# EAGLE schematic DL0WH_BiTuner_Ctrl_1V3 (EAGLE 7.7.0)

## Sheet 1 of 17: MCU
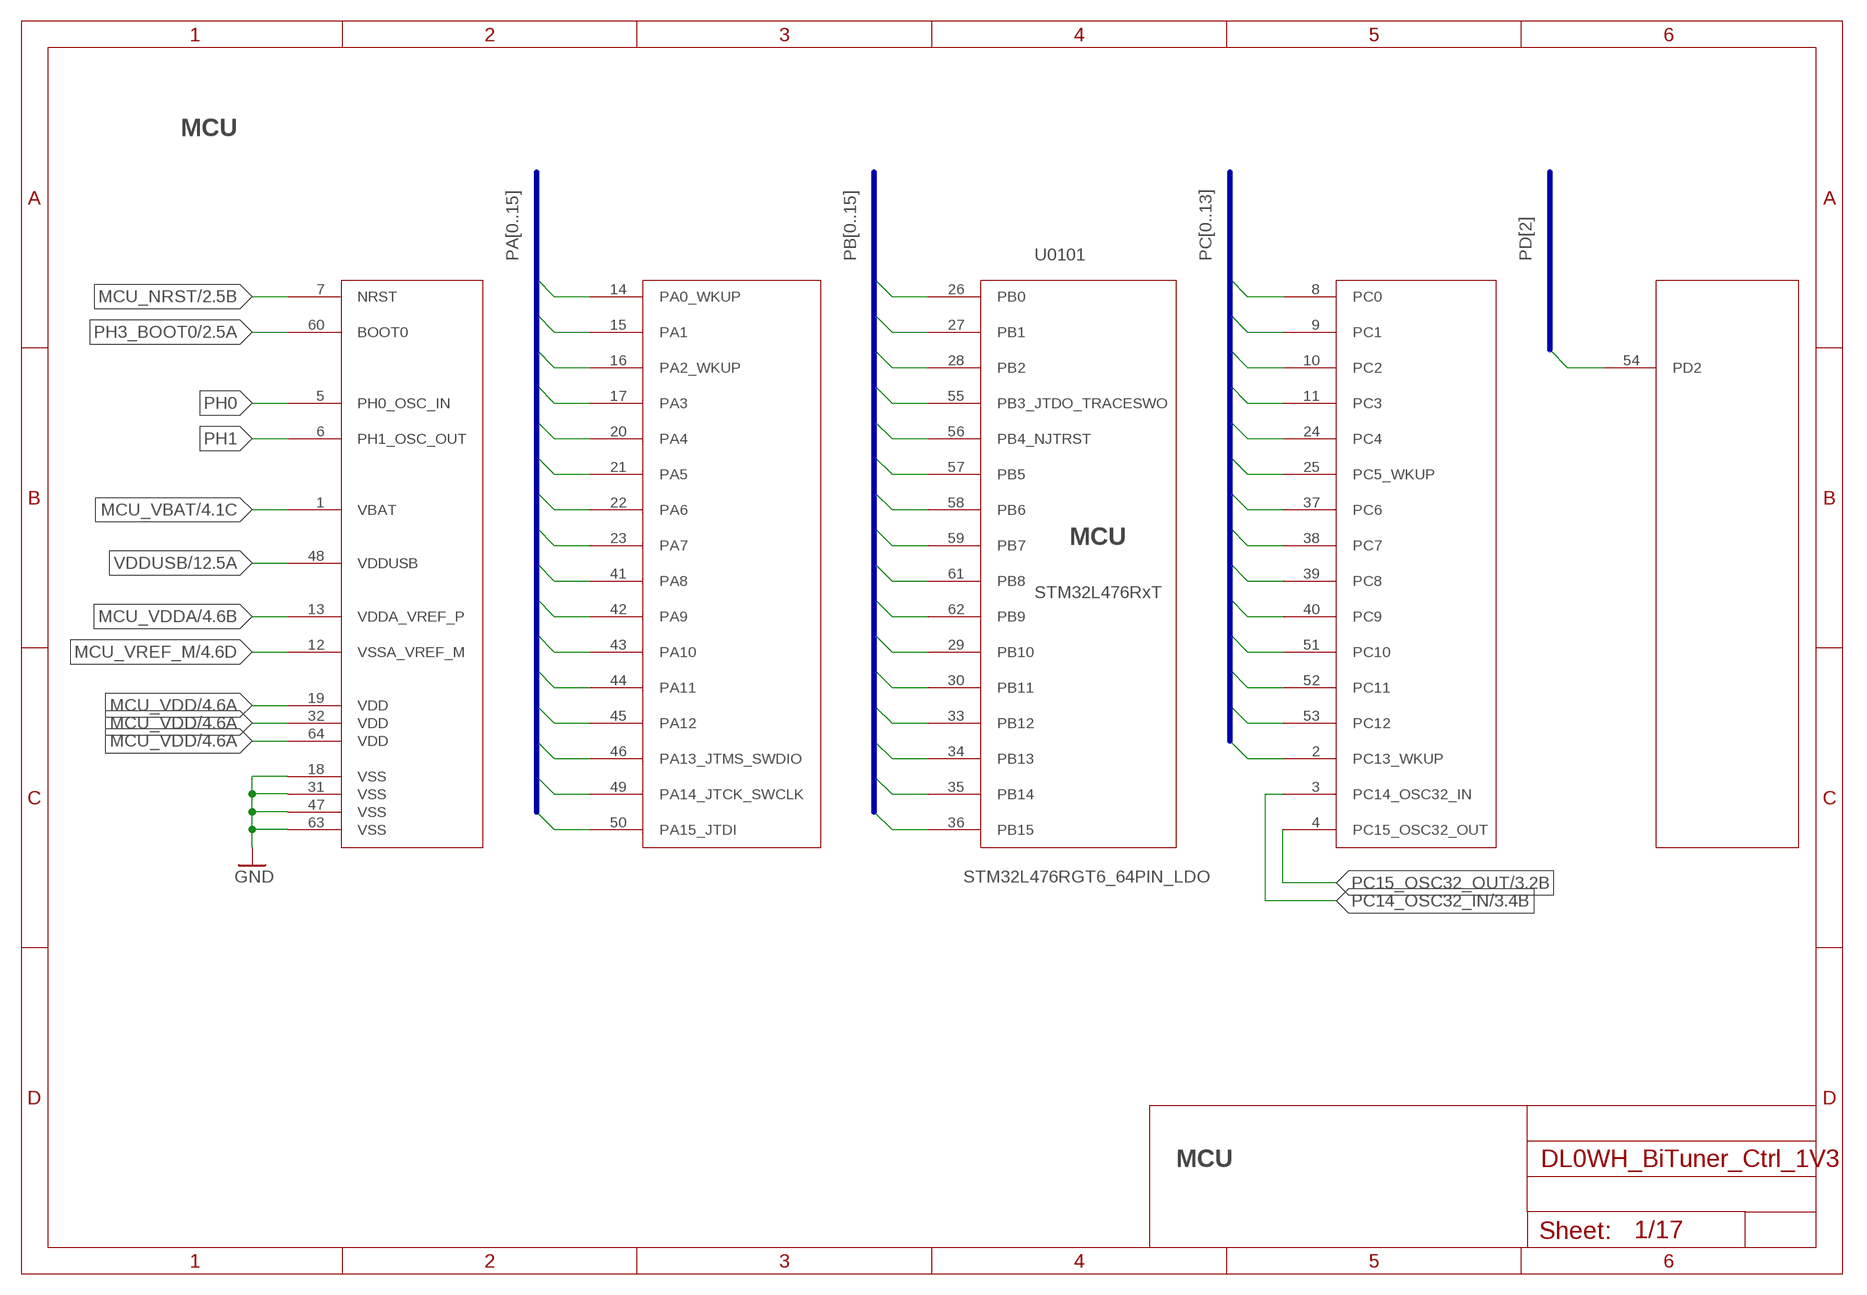
[diagram p0: schematic, sheet 1]

### Parts
U0101  STM32L476RGT6_64PIN_LDO  STM32L476RXT_64PIN_LDO  [LQFP64]

### Nets
GND: U0101.18(VSS) U0101.31(VSS) U0101.47(VSS) U0101.63(VSS) ; also sheet 2,3,4,5,6,7,8,9,10,11,12,13,14,15,17
MCU_NRST: U0101.7(NRST) ; also sheet 2
MCU_VBAT: U0101.1(VBAT) ; also sheet 4
MCU_VDD: U0101.19(VDD) U0101.32(VDD) U0101.64(VDD) ; also sheet 4
MCU_VDDA: U0101.13(VDDA_VREF_P) ; also sheet 4
MCU_VREF_M: U0101.12(VSSA_VREF_M) ; also sheet 4
PA0: U0101.14(PA0_WKUP) ; also sheet 11
PA1: U0101.15(PA1) ; also sheet 11
PA2: U0101.16(PA2_WKUP)
PA3: U0101.17(PA3) ; also sheet 9
PA4: U0101.20(PA4)
PA5: U0101.21(PA5) ; also sheet 6
PA6: U0101.22(PA6) ; also sheet 6
PA7: U0101.23(PA7) ; also sheet 6
PA8: U0101.41(PA8)
PA9: U0101.42(PA9) ; also sheet 14
PA10: U0101.43(PA10) ; also sheet 14
PA11: U0101.44(PA11) ; also sheet 14
PA12: U0101.45(PA12) ; also sheet 14
PA13: U0101.46(PA13_JTMS_SWDIO) ; also sheet 2
PA14: U0101.49(PA14_JTCK_SWCLK) ; also sheet 2
PA15: U0101.50(PA15_JTDI) ; also sheet 11
PB0: U0101.26(PB0) ; also sheet 6
PB1: U0101.27(PB1) ; also sheet 7
PB2: U0101.28(PB2) ; also sheet 8
PB3: U0101.55(PB3_JTDO_TRACESWO)
PB4: U0101.56(PB4_NJTRST)
PB5: U0101.57(PB5)
PB6: U0101.58(PB6) ; also sheet 5,9
PB7: U0101.59(PB7) ; also sheet 11
PB8: U0101.61(PB8)
PB9: U0101.62(PB9) ; also sheet 5,9
PB10 [mil6_nofill]: U0101.29(PB10) ; also sheet 10
PB11: U0101.30(PB11) ; also sheet 6
PB12: U0101.33(PB12) ; also sheet 10
PB13 [mil6_nofill]: U0101.34(PB13) ; also sheet 10
PB14: U0101.35(PB14)
PB15: U0101.36(PB15)
PC0 [mil6_nofill]: U0101.8(PC0) ; also sheet 9
PC1: U0101.9(PC1) ; also sheet 10
PC2 [mil6_nofill]: U0101.10(PC2) ; also sheet 9
PC3: U0101.11(PC3) ; also sheet 9
PC4: U0101.24(PC4) ; also sheet 6
PC5: U0101.25(PC5_WKUP)
PC6: U0101.37(PC6)
PC7: U0101.38(PC7)
PC8: U0101.39(PC8)
PC9: U0101.40(PC9)
PC10: U0101.51(PC10)
PC11: U0101.52(PC11)
PC12: U0101.53(PC12)
PC13: U0101.2(PC13_WKUP)
PC14_OSC32_IN: U0101.3(PC14_OSC32_IN) ; also sheet 3
PC15_OSC32_OUT: U0101.4(PC15_OSC32_OUT) ; also sheet 3
PD2: U0101.54(PD2)
PH0: U0101.5(PH0_OSC_IN)
PH1: U0101.6(PH1_OSC_OUT)
PH3_BOOT0: U0101.60(BOOT0) ; also sheet 2
VDDUSB: U0101.48(VDDUSB) ; also sheet 12,14

### Buses
PB[0..15]
PA[0..15]
PC[0..13]
PD[2]

### Notes on the sheet
- MCU
- MCU
- STM32L476RxT
- MCU

## Sheet 2 of 17: MCU Debug
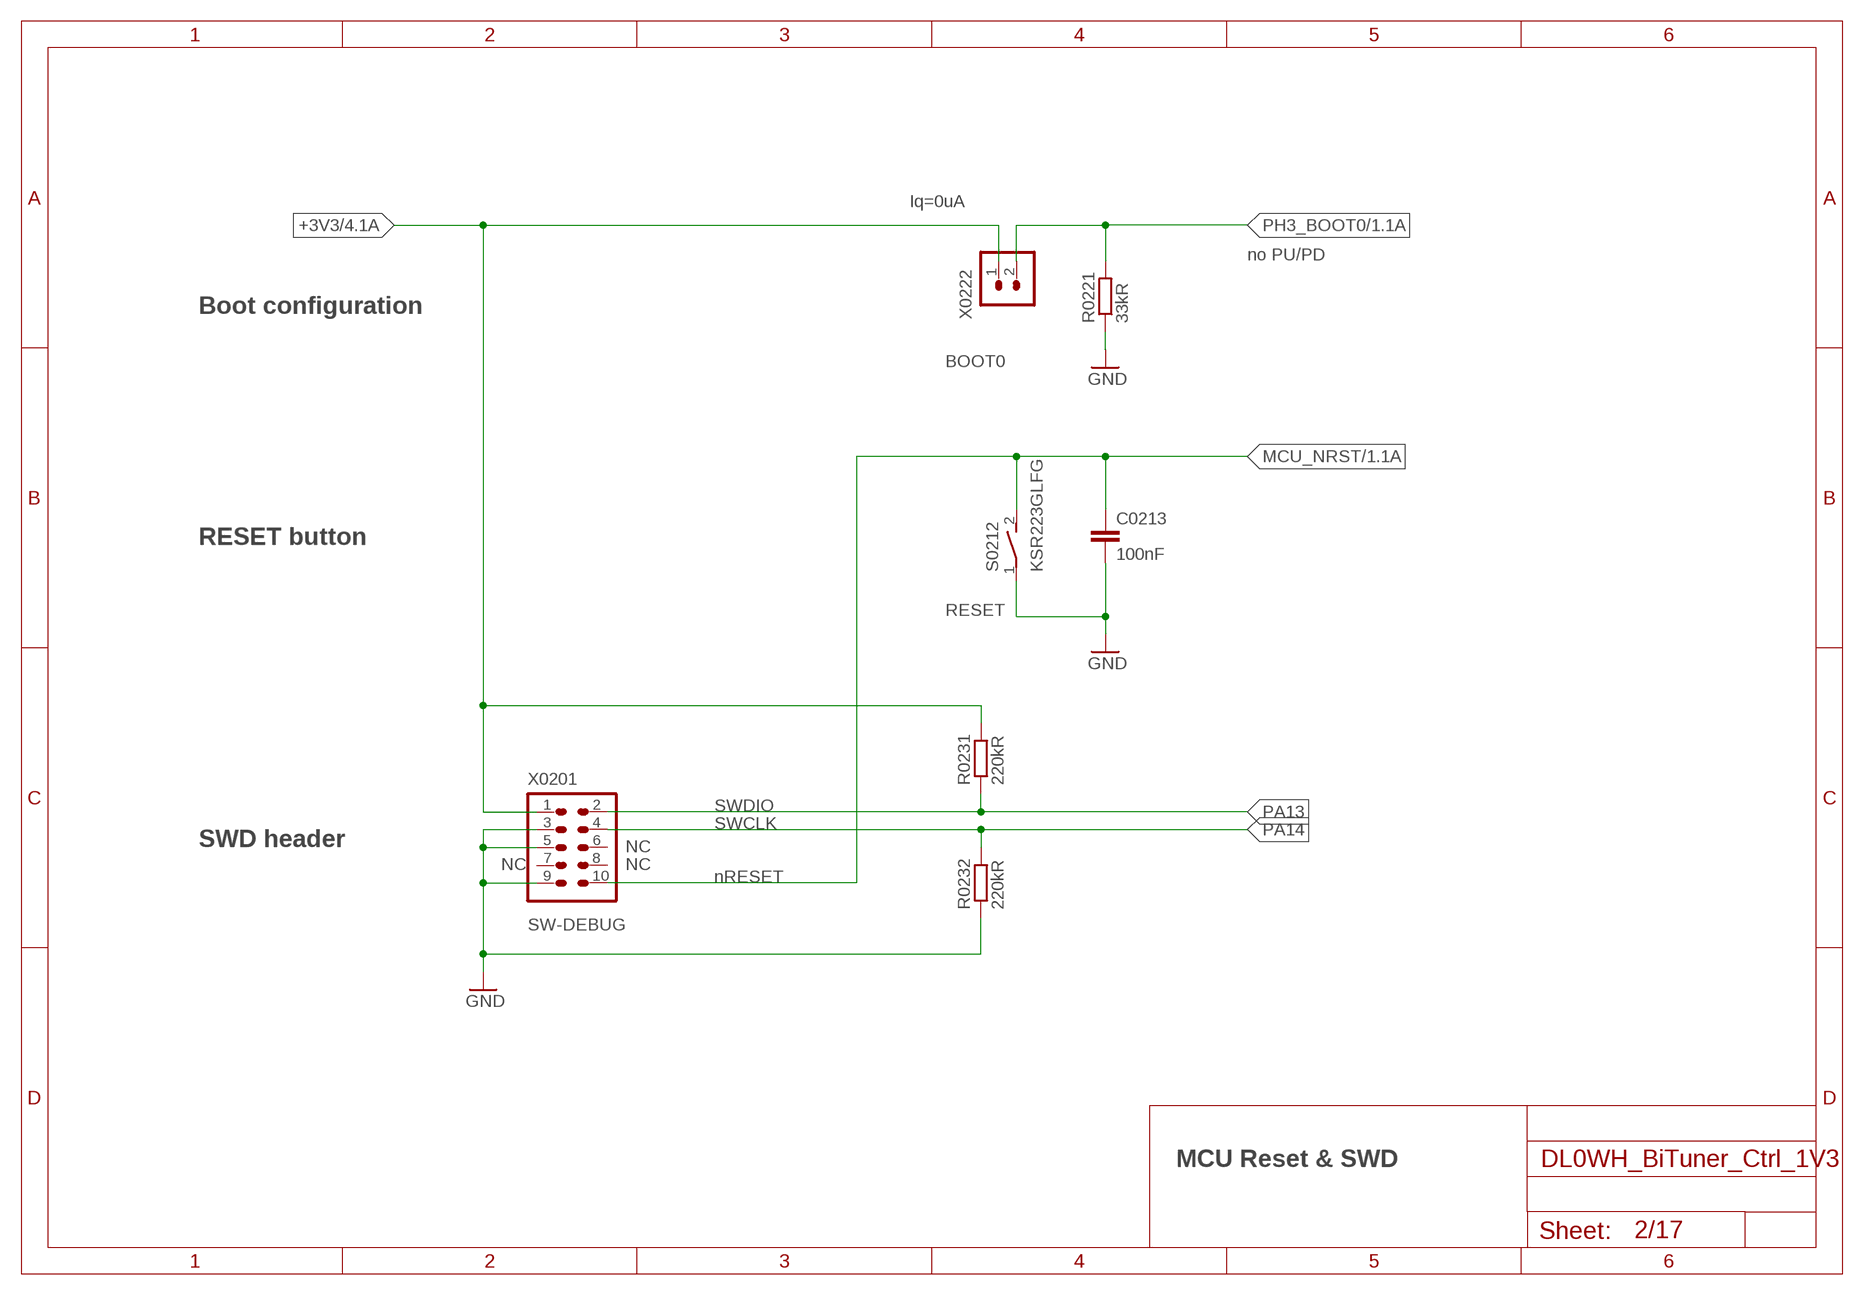
[diagram p1: schematic, sheet 2]

### Parts
C0213  100nF  C-EUC0402  [C0402]
R0221  33kR  R-EU_R0402  [R0402]
R0231  220kR  R-EU_R0402  [R0402]
R0232  220kR  R-EU_R0402  [R0402]
S0212  KSR223GLFG  KSR223G_SMD_1POL  [KSR223G_SMD_1POL]
X0201  FTSH-105-01-F-D-K  2X05_1MM27_SHROUDED_CORTEX_JTAG_SWD"  [2X05_1MM27_SHROUDED_CORTEX_JTAG_SWD]
X0222  HEADER-1X2  [1X02]

### Nets
+3V3: R0231.2 X0201.1 X0222.1 ; also sheet 4,5,6,7,8,9,13
GND: C0213.2 R0221.1 R0232.1 S0212.1(P) X0201.3 X0201.5 X0201.9 ; also sheet 1,3,4,5,6,7,8,9,10,11,12,13,14,15,17
MCU_NRST: C0213.1 S0212.2(S) X0201.10 ; also sheet 1
PA13: R0231.1 X0201.2 ; also sheet 1
PA14: R0232.2 X0201.4 ; also sheet 1
PH3_BOOT0: R0221.2 X0222.2 ; also sheet 1
Unconnected: X0201.6 X0201.7 X0201.8

### Notes on the sheet
- Iq=0uA
- no PU/PD
- Boot configuration
- BOOT0
- RESET button
- RESET
- SWDIO
- SWCLK
- SWD header
- NC
- NC | NC
- nRESET
- SW-DEBUG
- MCU Reset & SWD

## Sheet 3 of 17: MCU LSE 32.768 kHz
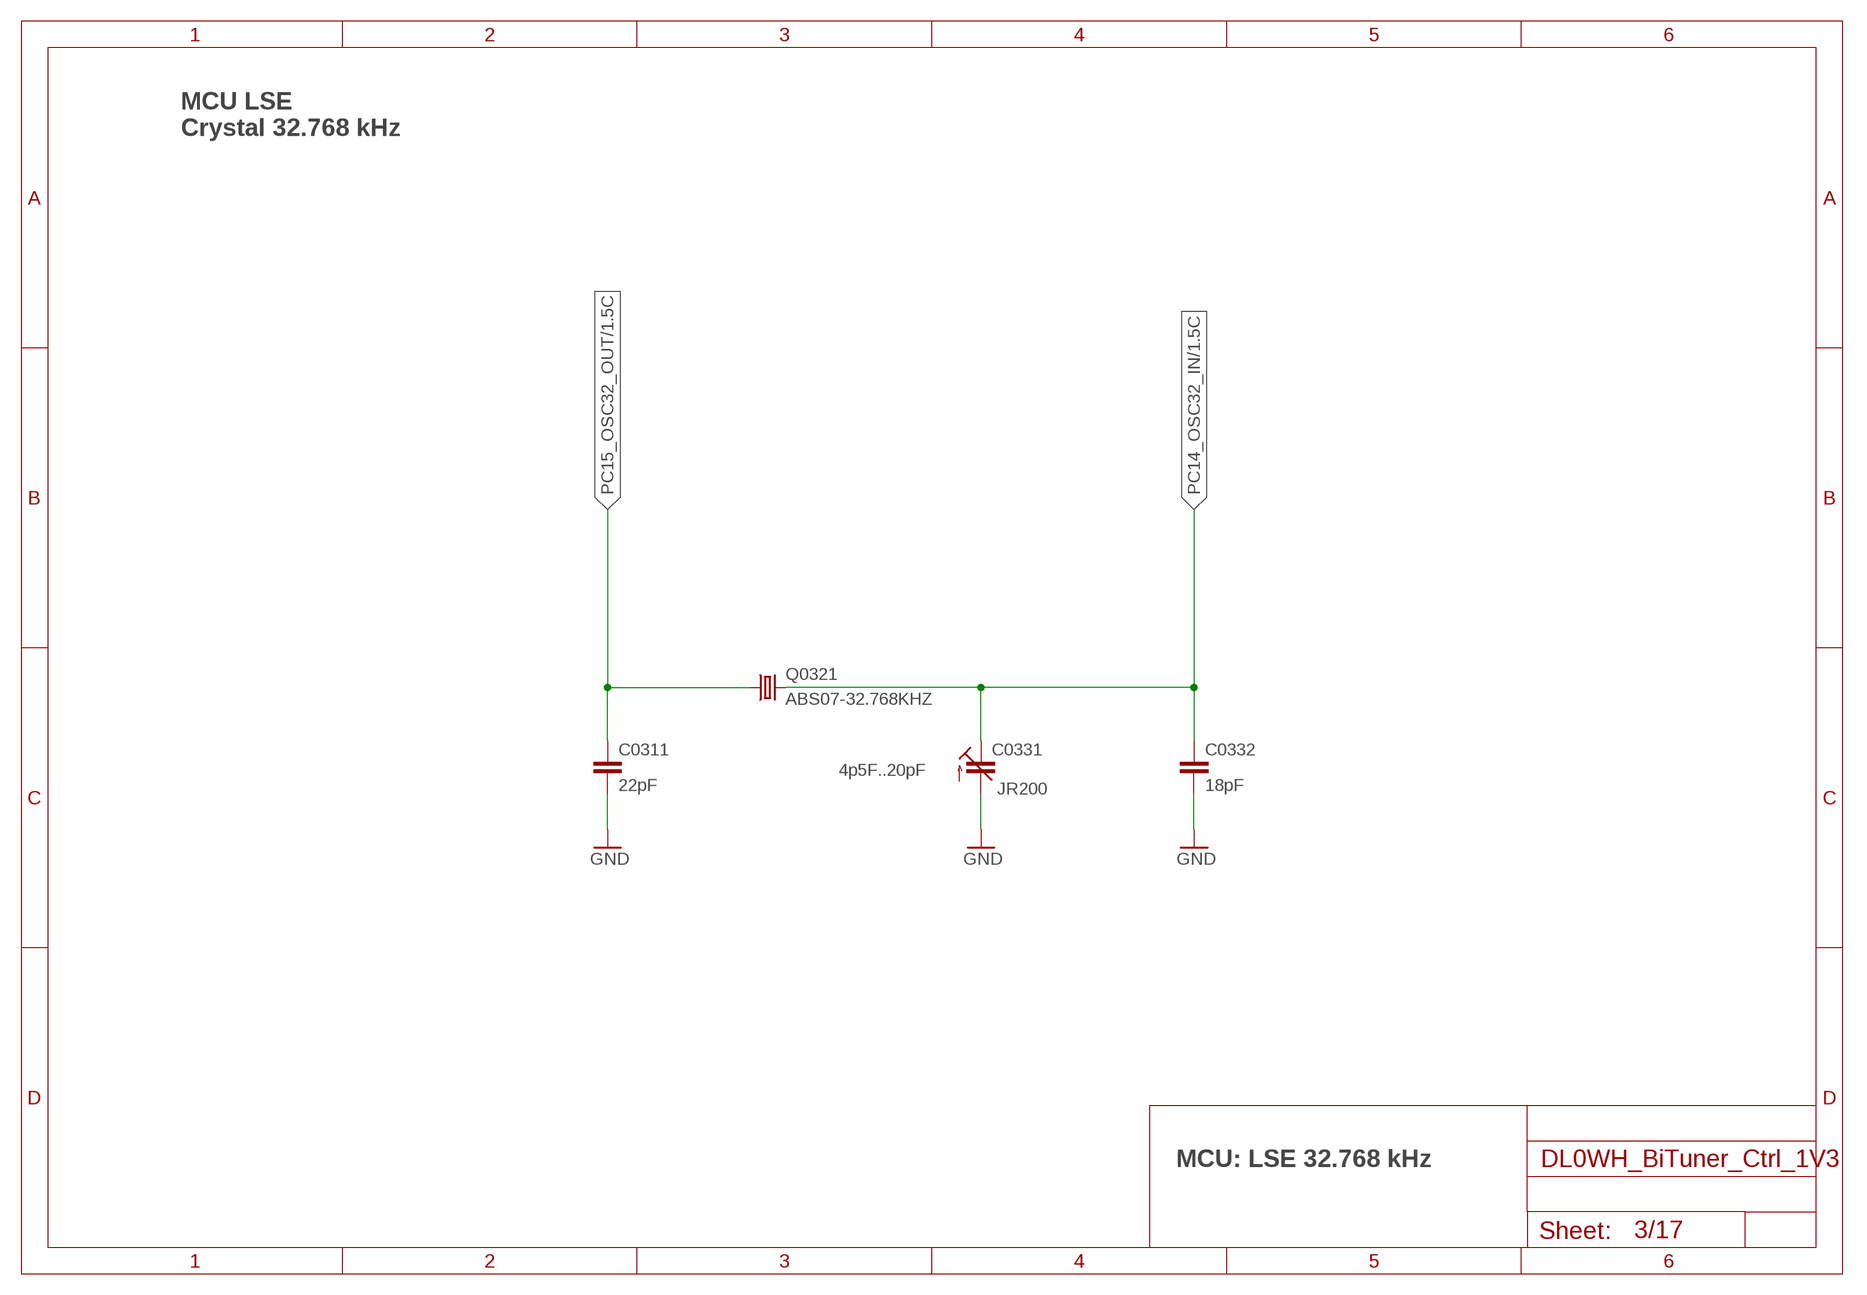
[diagram p2: schematic, sheet 3]

### Parts
C0311  22pF  C-EUC0402  [C0402]
C0331  JR200  C-TRIMM3MM2_2MM5  [3MM2_X_2MM5]
C0332  18pF  C-EUC0402  [C0402]
Q0321  ABS07-32.768KHZ  [ABS07]

### Nets
GND: C0311.2 C0331.+(A) C0332.2 ; also sheet 1,2,4,5,6,7,8,9,10,11,12,13,14,15,17
PC14_OSC32_IN: C0331.-(E) C0332.1 Q0321.2 ; also sheet 1
PC15_OSC32_OUT: C0311.1 Q0321.1 ; also sheet 1

### Notes on the sheet
- MCU LSE
  Crystal 32.768 kHz
- 4p5F..20pF
- MCU: LSE 32.768 kHz

## Sheet 4 of 17: MCU Power Distribution
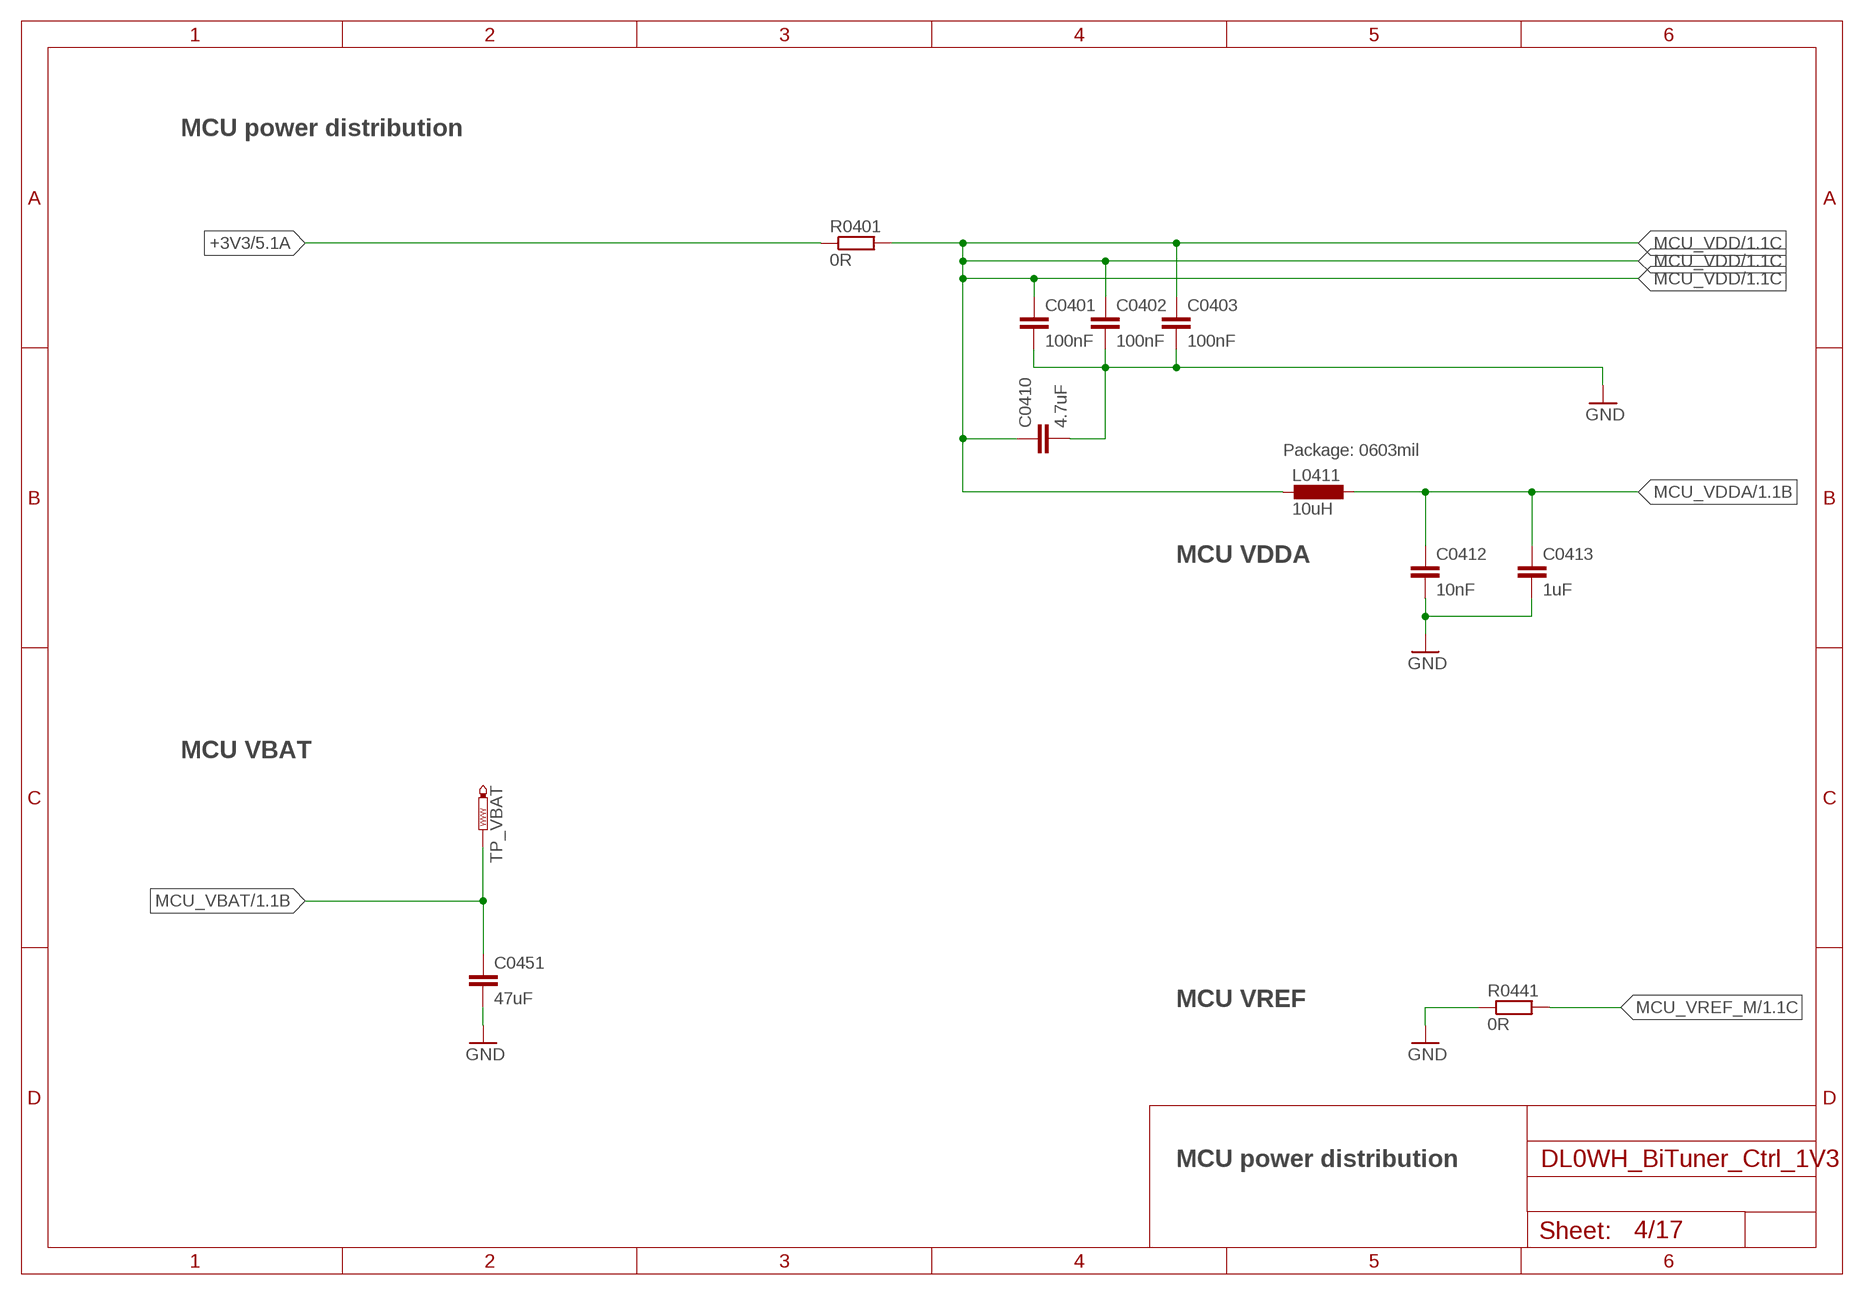
[diagram p3: schematic, sheet 4]

### Parts
C0401  100nF  C-EUC0402  [C0402]
C0402  100nF  C-EUC0402  [C0402]
C0403  100nF  C-EUC0402  [C0402]
C0410  4.7uF  C-EUC0603  [C0603]
C0412  10nF  C-EUC0402  [C0402]
C0413  1uF  C-EUC0402  [C0402]
C0451  47uF  C-EUC0805  [C0805]
L0411  10uH  L-EUL0603  [L0603]
R0401  0R  R-EU_R0402  [R0402]
R0441  0R  R-EU_R0402  [R0402]
TP_VBAT  PTR1B1,27  [B1,27]

### Nets
+3V3: R0401.1 ; also sheet 2,5,6,7,8,9,13
GND: C0401.2 C0402.2 C0403.2 C0410.2 C0412.2 C0413.2 C0451.2 R0441.1 ; also sheet 1,2,3,5,6,7,8,9,10,11,12,13,14,15,17
MCU_VBAT: C0451.1 TP_VBAT.TP ; also sheet 1
MCU_VDD: C0401.1 C0402.1 C0403.1 C0410.1 L0411.1 R0401.2 ; also sheet 1
MCU_VDDA: C0412.1 C0413.1 L0411.2 ; also sheet 1
MCU_VREF_M: R0441.2 ; also sheet 1

### Notes on the sheet
- MCU power distribution
- Package: 0603mil
- MCU VDDA
- MCU VBAT
- MCU VREF
- MCU power distribution

## Sheet 5 of 17: I2C1 Termination / Addr space
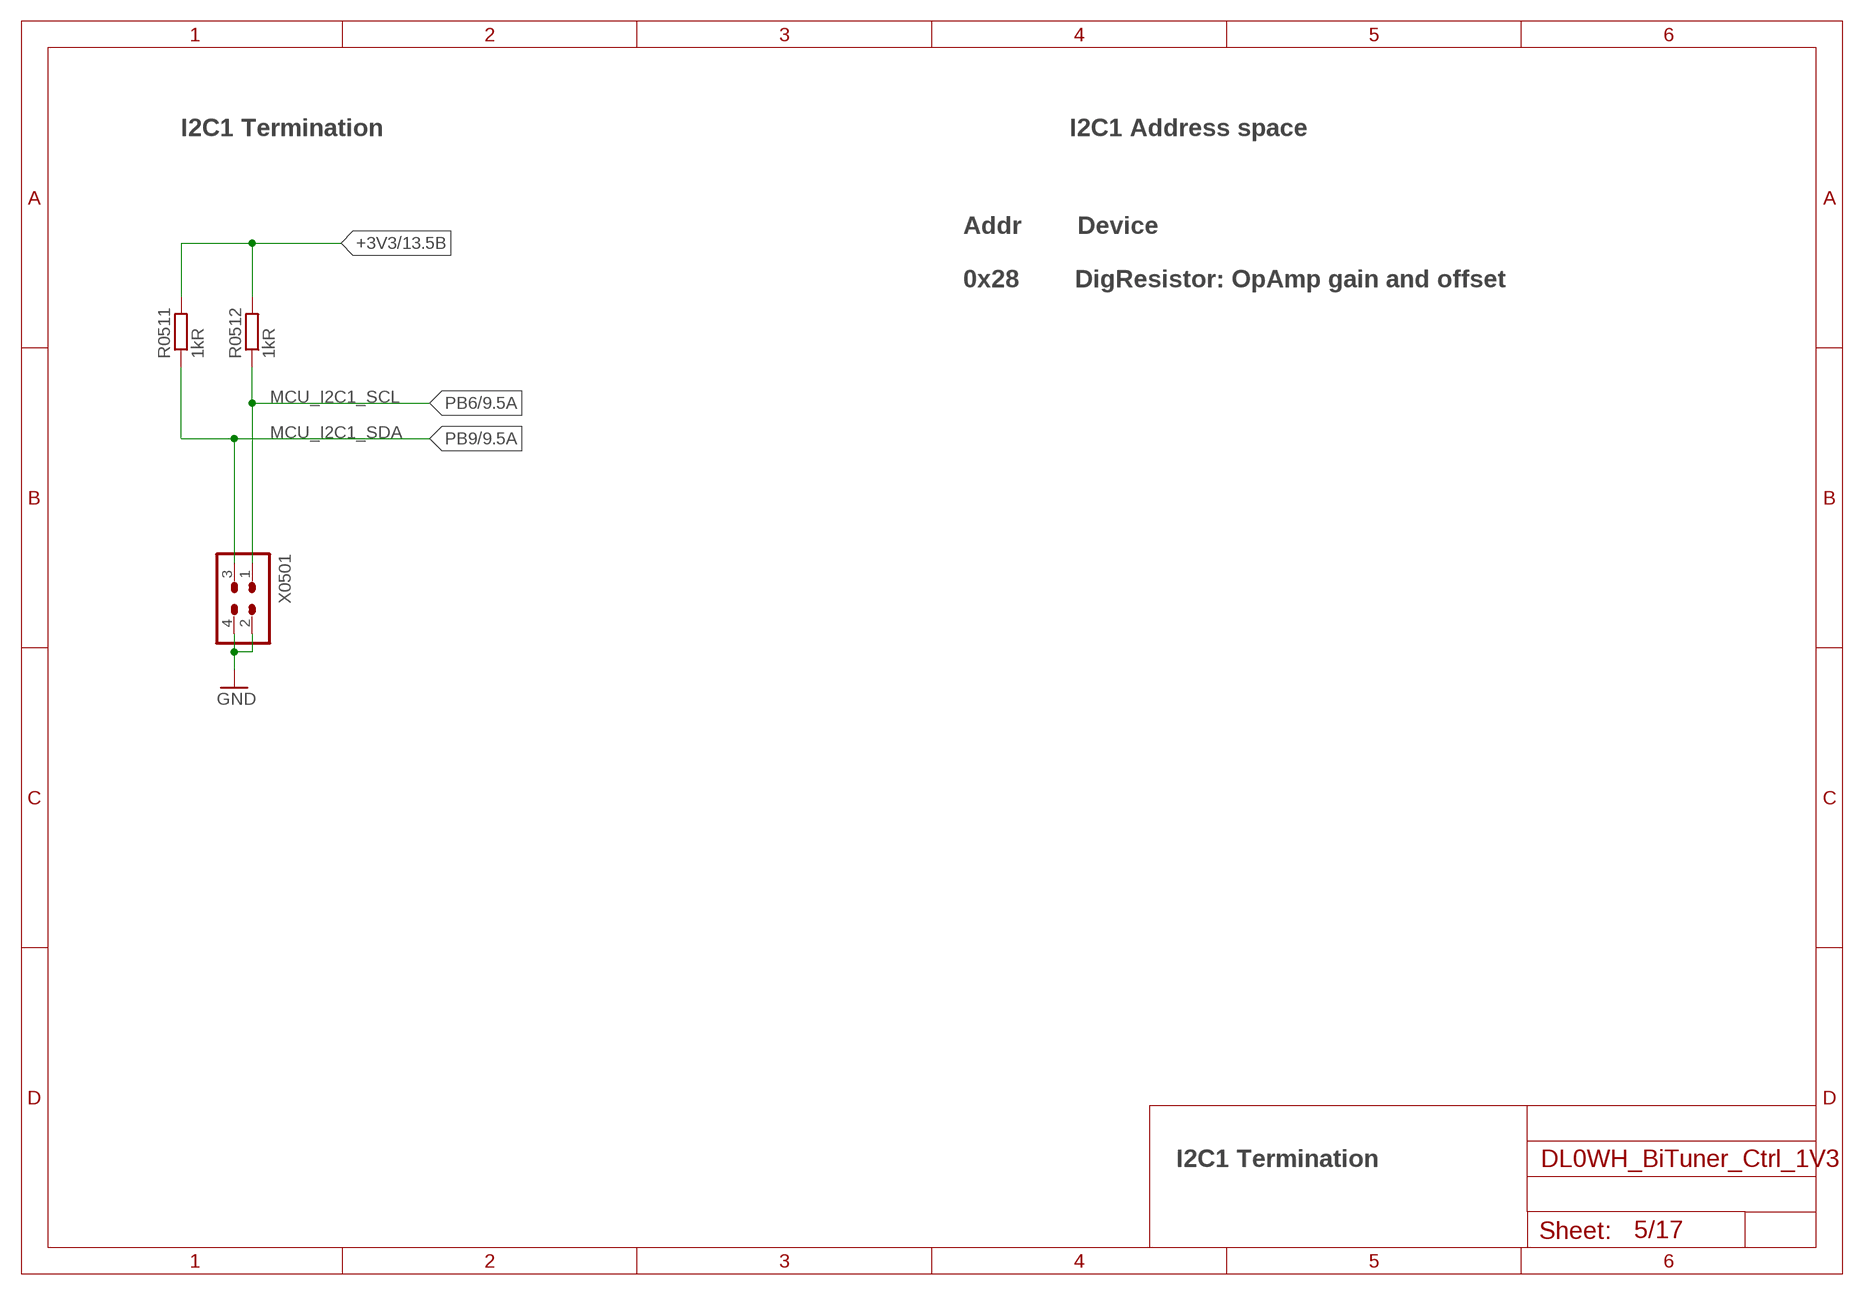
[diagram p4: schematic, sheet 5]

### Parts
R0511  1kR  R-EU_R0402  [R0402]
R0512  1kR  R-EU_R0402  [R0402]
X0501  HEADER-2X2  [2X02]

### Nets
+3V3: R0511.2 R0512.2 ; also sheet 2,4,6,7,8,9,13
GND: X0501.2 X0501.4 ; also sheet 1,2,3,4,6,7,8,9,10,11,12,13,14,15,17
PB6: R0512.1 X0501.1 ; also sheet 1,9
PB9: R0511.1 X0501.3 ; also sheet 1,9

### Notes on the sheet
- I2C1 Termination | I2C1 Address space
- Addr        Device
  
  0x28        DigResistor: OpAmp gain and offset
- MCU_I2C1_SCL
- MCU_I2C1_SDA
- I2C1 Termination

## Sheet 6 of 17: SPI solenoid driver - L
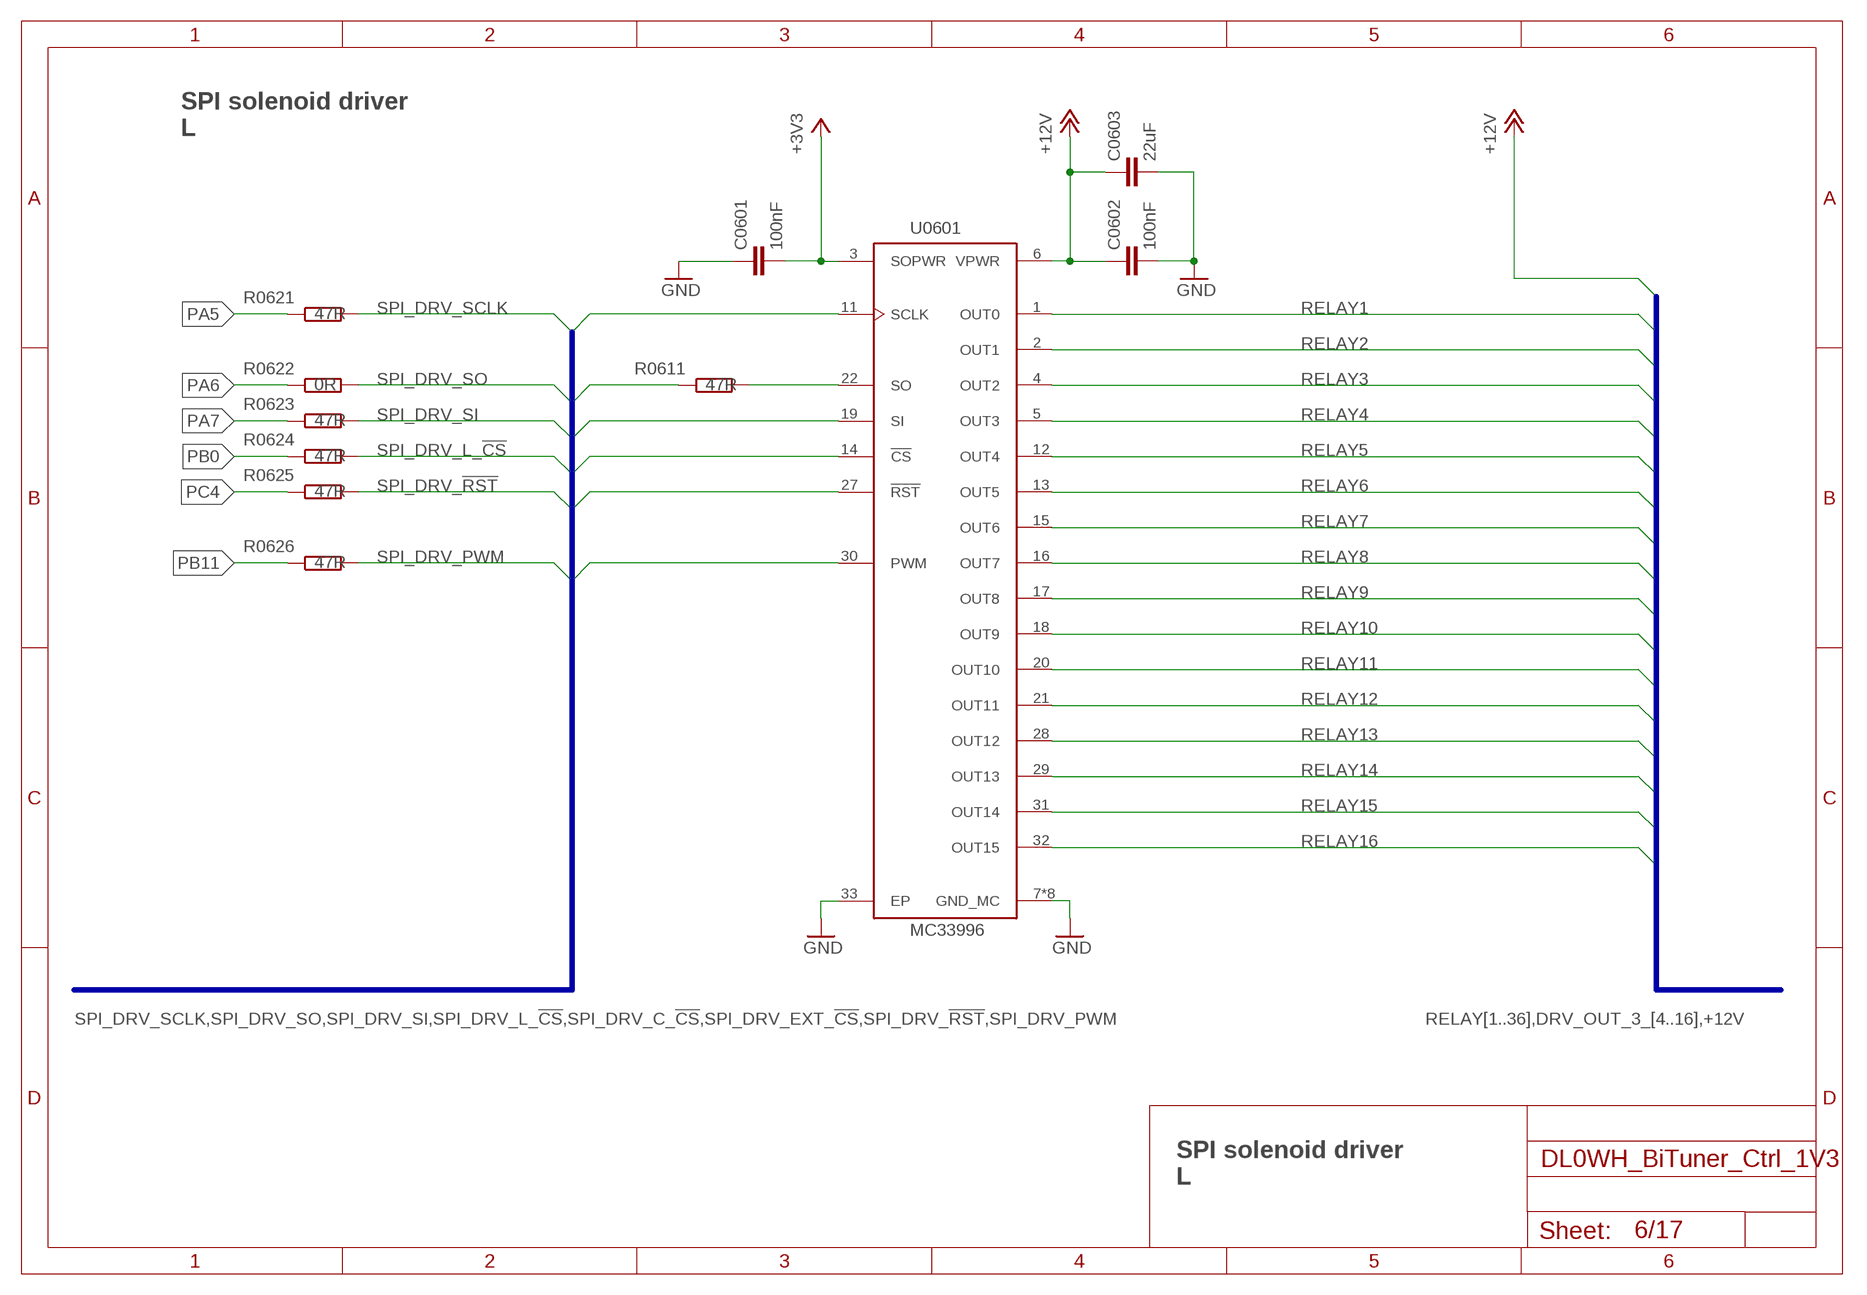
[diagram p5: schematic, sheet 6]

### Parts
C0601  100nF  C-EUC0402  [C0402]
C0602  100nF  C-EUC0402  [C0402]
C0603  22uF  C-EUC0603  [C0603]
R0611  47R  R-EU_R0402  [R0402]
R0621  47R  R-EU_R0402  [R0402]
R0622  0R  R-EU_R0402  [R0402]
R0623  47R  R-EU_R0402  [R0402]
R0624  47R  R-EU_R0402  [R0402]
R0625  47R  R-EU_R0402  [R0402]
R0626  47R  R-EU_R0402  [R0402]
U0601  MC33996  [SOICW32]

### Nets
+3V3: C0601.2 U0601.3(SOPWR) ; also sheet 2,4,5,7,8,9,13
+12V: C0602.1 C0603.1 U0601.6(VPWR) ; also sheet 7,8,12,16
GND: C0601.1 C0602.2 C0603.2 U0601.7(GND_MC) U0601.8(GND_MC) U0601.9(GND_MC) U0601.10(GND_MC) U0601.23(GND_MC) U0601.24(GND_MC) U0601.25(GND_MC) U0601.26(GND_MC) U0601.33(EP) ; also sheet 1,2,3,4,5,7,8,9,10,11,12,13,14,15,17
N$12: R0611.2 U0601.22(SO)
PA5: R0621.1 ; also sheet 1
PA6: R0622.1 ; also sheet 1
PA7: R0623.1 ; also sheet 1
PB0: R0624.1 ; also sheet 1
PB11: R0626.1 ; also sheet 1
PC4: R0625.1 ; also sheet 1
RELAY1 [mil6_nofill]: U0601.1(OUT0) ; also sheet 16
RELAY2 [mil6_nofill]: U0601.2(OUT1) ; also sheet 16
RELAY3 [mil6_nofill]: U0601.4(OUT2) ; also sheet 16
RELAY4 [mil6_nofill]: U0601.5(OUT3) ; also sheet 16
RELAY5 [mil6_nofill]: U0601.12(OUT4) ; also sheet 16
RELAY6 [mil6_nofill]: U0601.13(OUT5) ; also sheet 16
RELAY7 [mil6_nofill]: U0601.15(OUT6) ; also sheet 16
RELAY8 [mil6_nofill]: U0601.16(OUT7) ; also sheet 16
RELAY9: U0601.17(OUT8) ; also sheet 16
RELAY10 [mil6_nofill]: U0601.18(OUT9) ; also sheet 16
RELAY11 [mil6_nofill]: U0601.20(OUT10) ; also sheet 16
RELAY12 [mil6_nofill]: U0601.21(OUT11) ; also sheet 16
RELAY13: U0601.28(OUT12) ; also sheet 16
RELAY14: U0601.29(OUT13) ; also sheet 16
RELAY15: U0601.31(OUT14) ; also sheet 16
RELAY16 [mil6_nofill]: U0601.32(OUT15) ; also sheet 16
SPI_DRV_!RST [mil6_nofill]: R0625.2 U0601.27(!RST) ; also sheet 7,8
SPI_DRV_L_!CS [mil6_nofill]: R0624.2 U0601.14(!CS)
SPI_DRV_PWM [mil6_nofill]: R0626.2 U0601.30(PWM) ; also sheet 7,8
SPI_DRV_SCLK [mil6_nofill]: R0621.2 U0601.11(SCLK) ; also sheet 7,8
SPI_DRV_SI [mil6_nofill]: R0623.2 U0601.19(SI) ; also sheet 7,8
SPI_DRV_SO [mil6_nofill]: R0611.1 R0622.2 ; also sheet 7,8

### Buses
RELAY[1..36],DRV_OUT_3_[4..16],+12V
SPI_DRV_SCLK,SPI_DRV_SO,SPI_DRV_SI,SPI_DRV_L_!CS,SPI_DRV_C_!CS,SPI_DRV_EXT_!CS,SPI_DRV_!RST,SPI_DRV_PWM

### Notes on the sheet
- SPI solenoid driver
  L
- SPI solenoid driver
  L

## Sheet 7 of 17: SPI solenoid driver - C
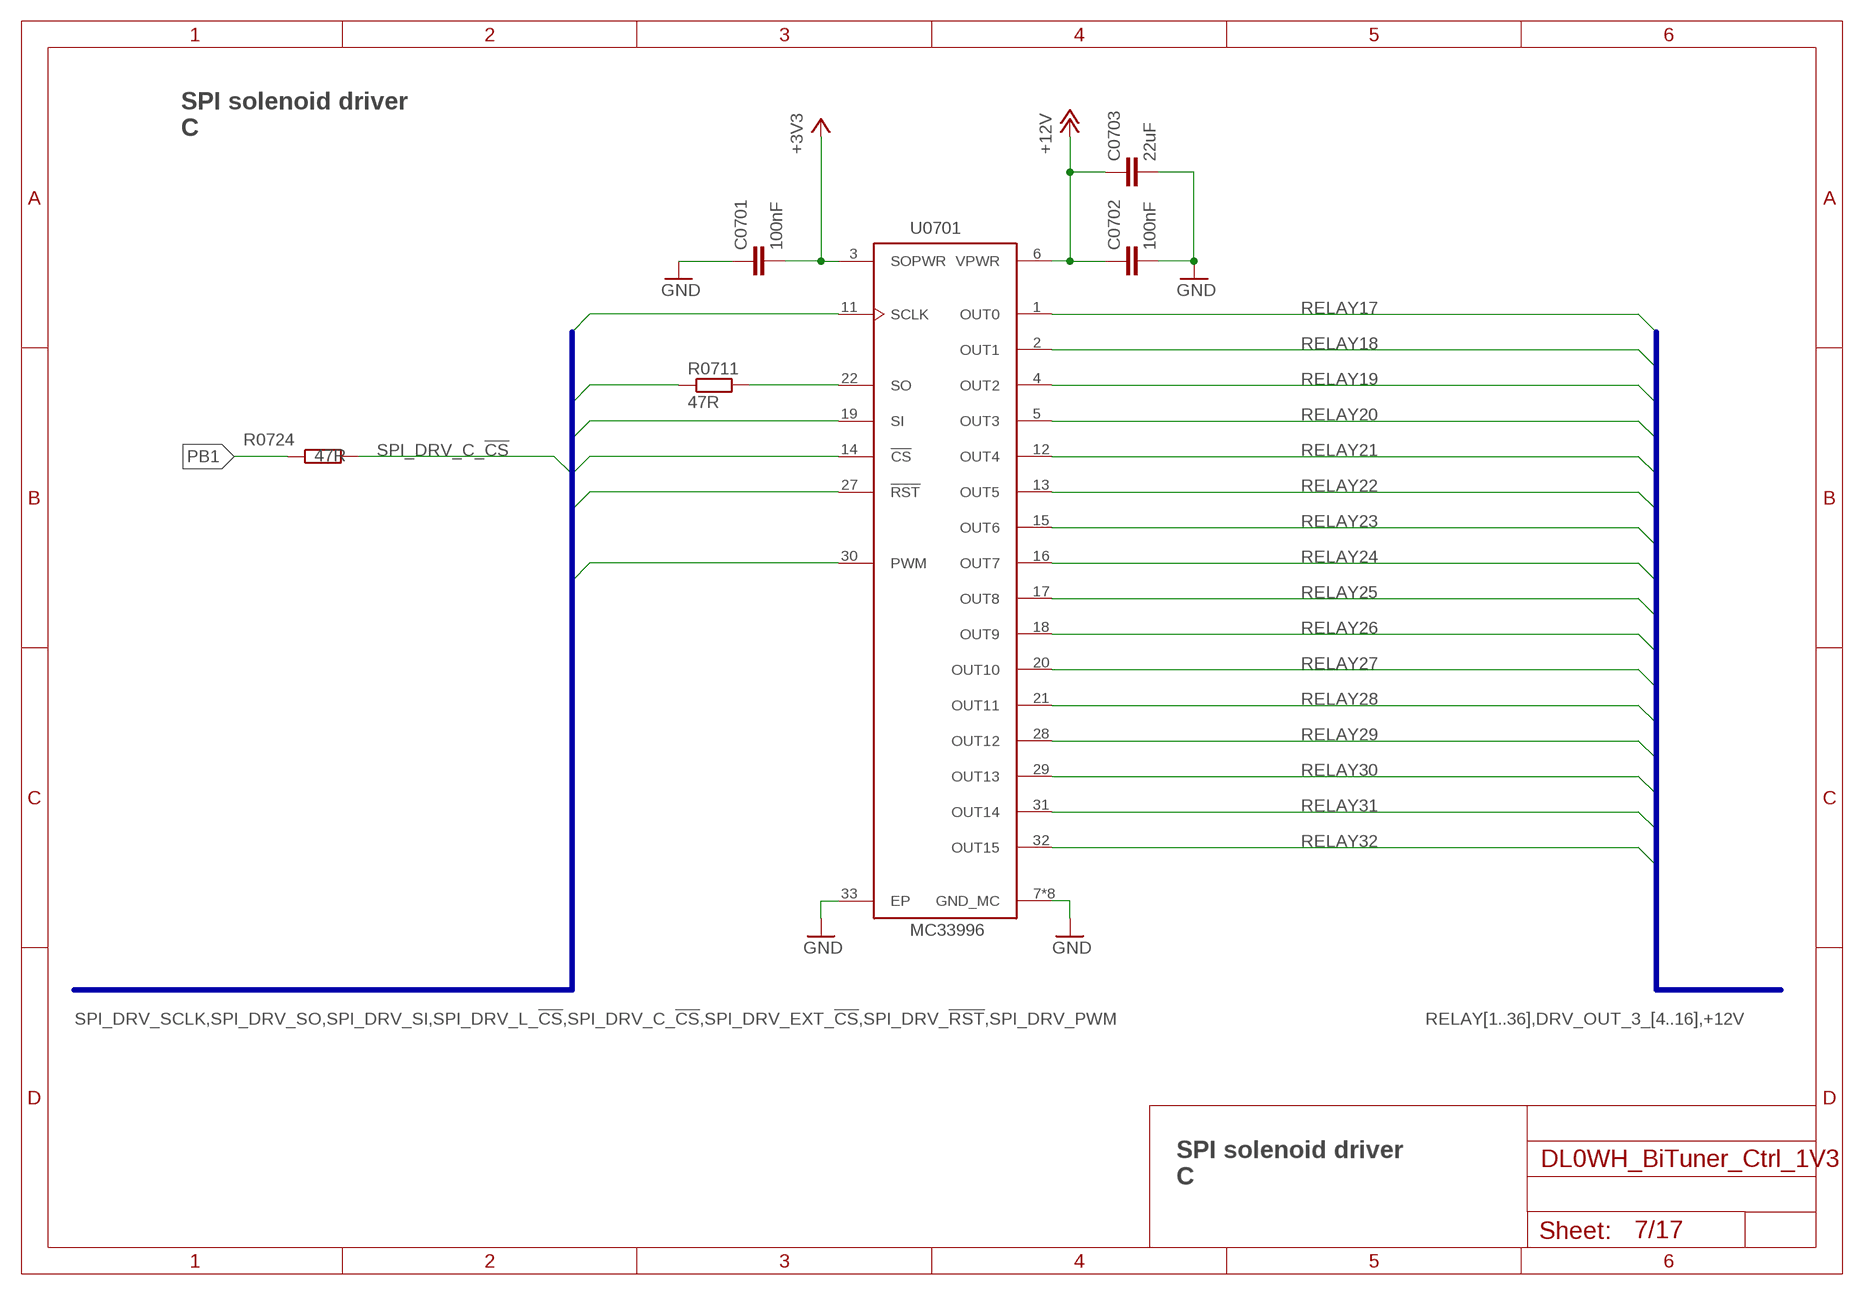
[diagram p6: schematic, sheet 7]

### Parts
C0701  100nF  C-EUC0402  [C0402]
C0702  100nF  C-EUC0402  [C0402]
C0703  22uF  C-EUC0603  [C0603]
R0711  47R  R-EU_R0402  [R0402]
R0724  47R  R-EU_R0402  [R0402]
U0701  MC33996  [SOICW32]

### Nets
+3V3: C0701.2 U0701.3(SOPWR) ; also sheet 2,4,5,6,8,9,13
+12V: C0702.1 C0703.1 U0701.6(VPWR) ; also sheet 6,8,12,16
GND: C0701.1 C0702.2 C0703.2 U0701.7(GND_MC) U0701.8(GND_MC) U0701.9(GND_MC) U0701.10(GND_MC) U0701.23(GND_MC) U0701.24(GND_MC) U0701.25(GND_MC) U0701.26(GND_MC) U0701.33(EP) ; also sheet 1,2,3,4,5,6,8,9,10,11,12,13,14,15,17
N$13: R0711.2 U0701.22(SO)
PB1: R0724.1 ; also sheet 1
RELAY17 [mil6_nofill]: U0701.1(OUT0) ; also sheet 16
RELAY18 [mil6_nofill]: U0701.2(OUT1) ; also sheet 16
RELAY19 [mil6_nofill]: U0701.4(OUT2) ; also sheet 16
RELAY20 [mil6_nofill]: U0701.5(OUT3) ; also sheet 16
RELAY21 [mil6_nofill]: U0701.12(OUT4) ; also sheet 16
RELAY22 [mil6_nofill]: U0701.13(OUT5) ; also sheet 16
RELAY23 [mil6_nofill]: U0701.15(OUT6) ; also sheet 16
RELAY24 [mil6_nofill]: U0701.16(OUT7) ; also sheet 16
RELAY25 [mil6_nofill]: U0701.17(OUT8) ; also sheet 16
RELAY26 [mil6_nofill]: U0701.18(OUT9) ; also sheet 16
RELAY27 [mil6_nofill]: U0701.20(OUT10) ; also sheet 16
RELAY28 [mil6_nofill]: U0701.21(OUT11) ; also sheet 16
RELAY29 [mil6_nofill]: U0701.28(OUT12) ; also sheet 16
RELAY30 [mil6_nofill]: U0701.29(OUT13) ; also sheet 16
RELAY31 [mil6_nofill]: U0701.31(OUT14) ; also sheet 16
RELAY32 [mil6_nofill]: U0701.32(OUT15) ; also sheet 16
SPI_DRV_!RST [mil6_nofill]: U0701.27(!RST) ; also sheet 6,8
SPI_DRV_C_!CS [mil6_nofill]: R0724.2 U0701.14(!CS)
SPI_DRV_PWM [mil6_nofill]: U0701.30(PWM) ; also sheet 6,8
SPI_DRV_SCLK [mil6_nofill]: U0701.11(SCLK) ; also sheet 6,8
SPI_DRV_SI [mil6_nofill]: U0701.19(SI) ; also sheet 6,8
SPI_DRV_SO [mil6_nofill]: R0711.1 ; also sheet 6,8

### Buses
RELAY[1..36],DRV_OUT_3_[4..16],+12V
SPI_DRV_SCLK,SPI_DRV_SO,SPI_DRV_SI,SPI_DRV_L_!CS,SPI_DRV_C_!CS,SPI_DRV_EXT_!CS,SPI_DRV_!RST,SPI_DRV_PWM

### Notes on the sheet
- SPI solenoid driver
  C
- SPI solenoid driver
  C

## Sheet 8 of 17: SPI solenoid driver - extra
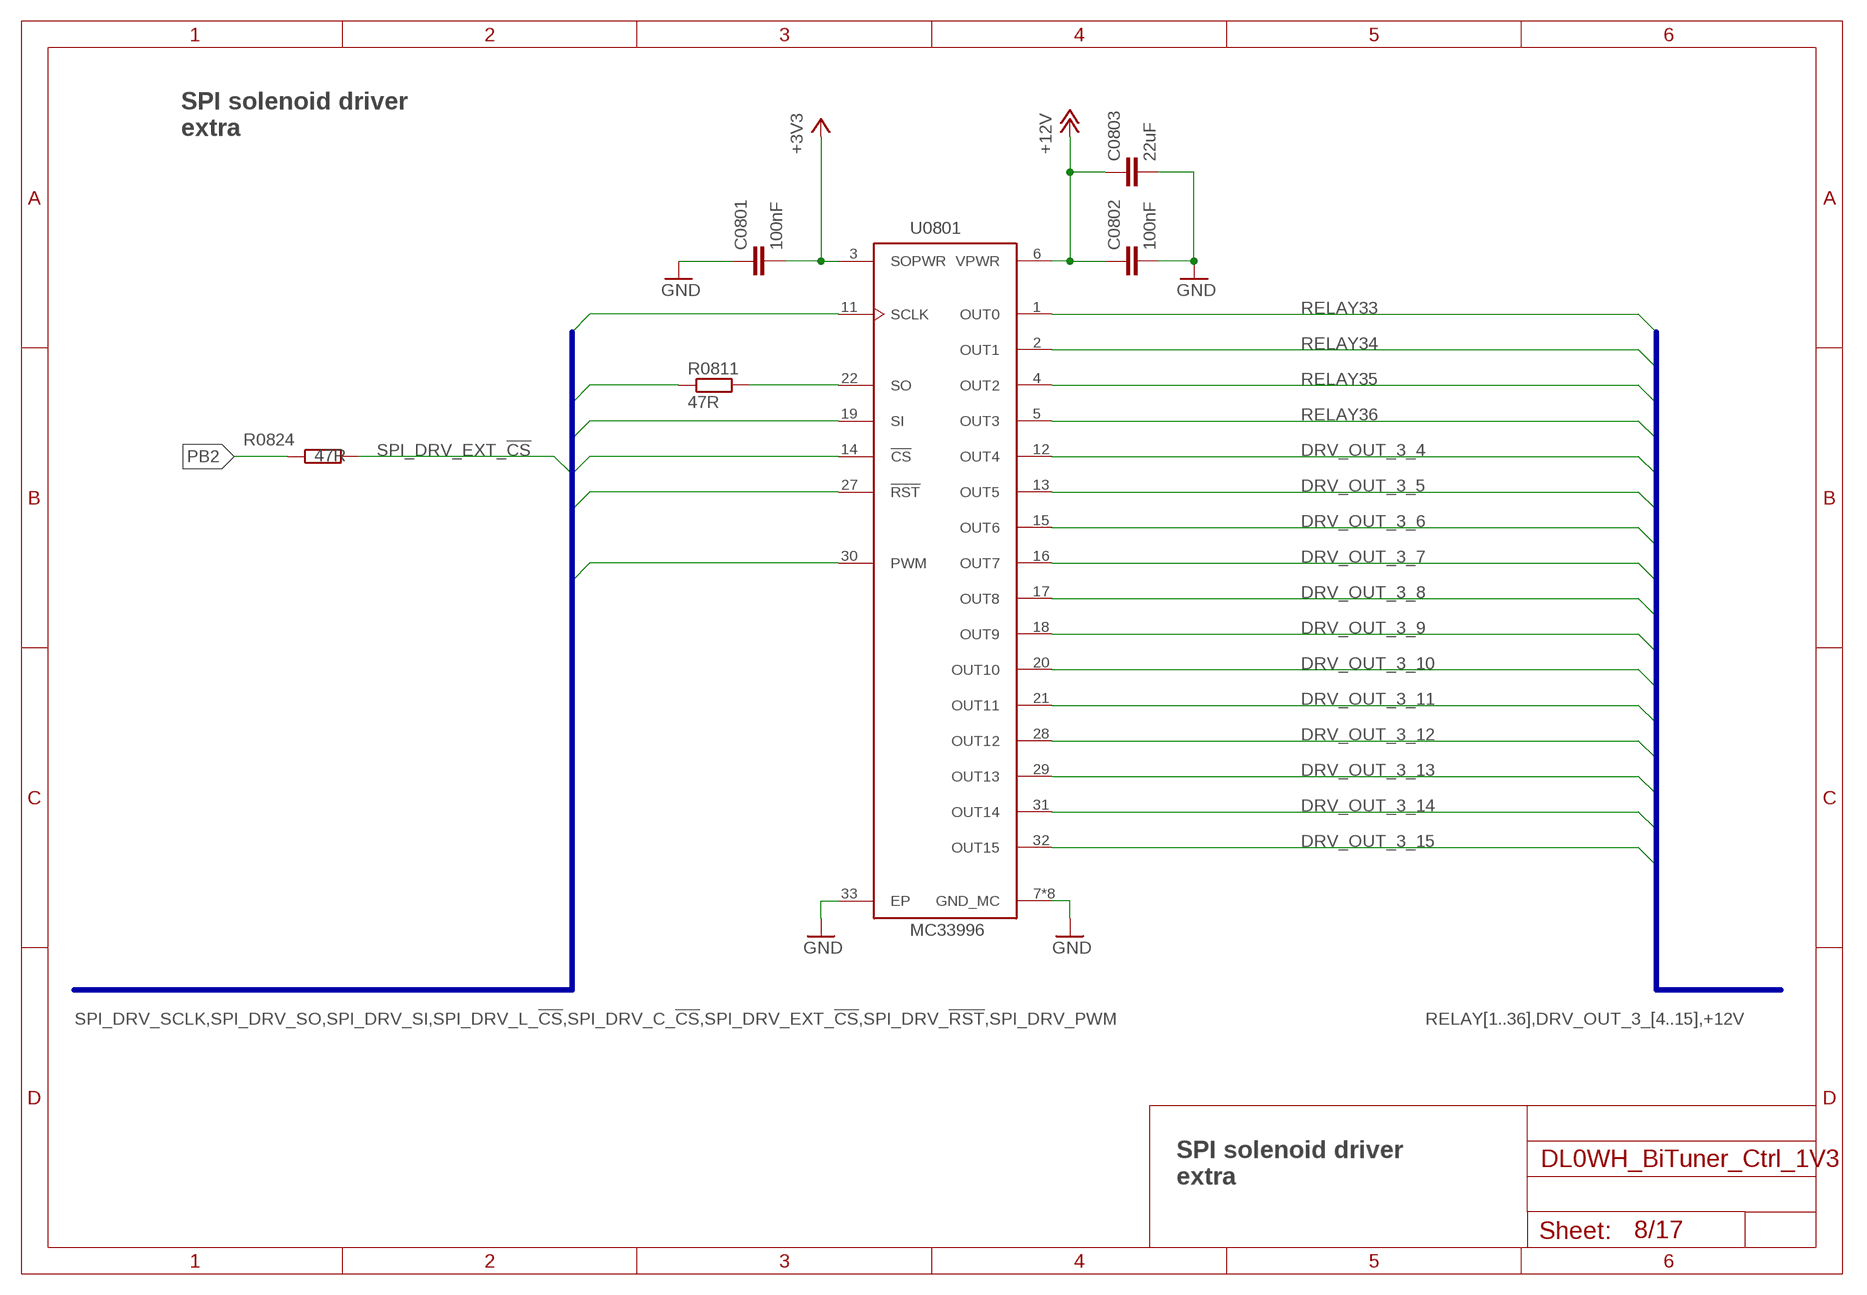
[diagram p7: schematic, sheet 8]

### Parts
C0801  100nF  C-EUC0402  [C0402]
C0802  100nF  C-EUC0402  [C0402]
C0803  22uF  C-EUC0603  [C0603]
R0811  47R  R-EU_R0402  [R0402]
R0824  47R  R-EU_R0402  [R0402]
U0801  MC33996  [SOICW32]

### Nets
+3V3: C0801.2 U0801.3(SOPWR) ; also sheet 2,4,5,6,7,9,13
+12V: C0802.1 C0803.1 U0801.6(VPWR) ; also sheet 6,7,12,16
DRV_OUT_3_4: U0801.12(OUT4)
DRV_OUT_3_5: U0801.13(OUT5)
DRV_OUT_3_6: U0801.15(OUT6)
DRV_OUT_3_7: U0801.16(OUT7)
DRV_OUT_3_8: U0801.17(OUT8)
DRV_OUT_3_9: U0801.18(OUT9)
DRV_OUT_3_10: U0801.20(OUT10)
DRV_OUT_3_11: U0801.21(OUT11)
DRV_OUT_3_12: U0801.28(OUT12)
DRV_OUT_3_13: U0801.29(OUT13)
DRV_OUT_3_14: U0801.31(OUT14)
DRV_OUT_3_15: U0801.32(OUT15)
GND: C0801.1 C0802.2 C0803.2 U0801.7(GND_MC) U0801.8(GND_MC) U0801.9(GND_MC) U0801.10(GND_MC) U0801.23(GND_MC) U0801.24(GND_MC) U0801.25(GND_MC) U0801.26(GND_MC) U0801.33(EP) ; also sheet 1,2,3,4,5,6,7,9,10,11,12,13,14,15,17
N$15: R0811.2 U0801.22(SO)
PB2: R0824.1 ; also sheet 1
RELAY33 [mil6_nofill]: U0801.1(OUT0) ; also sheet 16
RELAY34 [mil6_nofill]: U0801.2(OUT1) ; also sheet 16
RELAY35 [mil6_nofill]: U0801.4(OUT2) ; also sheet 16
RELAY36 [mil6_nofill]: U0801.5(OUT3) ; also sheet 16
SPI_DRV_!RST [mil6_nofill]: U0801.27(!RST) ; also sheet 6,7
SPI_DRV_EXT_!CS [mil6_nofill]: R0824.2 U0801.14(!CS)
SPI_DRV_PWM [mil6_nofill]: U0801.30(PWM) ; also sheet 6,7
SPI_DRV_SCLK [mil6_nofill]: U0801.11(SCLK) ; also sheet 6,7
SPI_DRV_SI [mil6_nofill]: U0801.19(SI) ; also sheet 6,7
SPI_DRV_SO [mil6_nofill]: R0811.1 ; also sheet 6,7

### Buses
RELAY[1..36],DRV_OUT_3_[4..15],+12V
SPI_DRV_SCLK,SPI_DRV_SO,SPI_DRV_SI,SPI_DRV_L_!CS,SPI_DRV_C_!CS,SPI_DRV_EXT_!CS,SPI_DRV_!RST,SPI_DRV_PWM

### Notes on the sheet
- SPI solenoid driver
  extra
- SPI solenoid driver
  extra

## Sheet 9 of 17: SWR metering
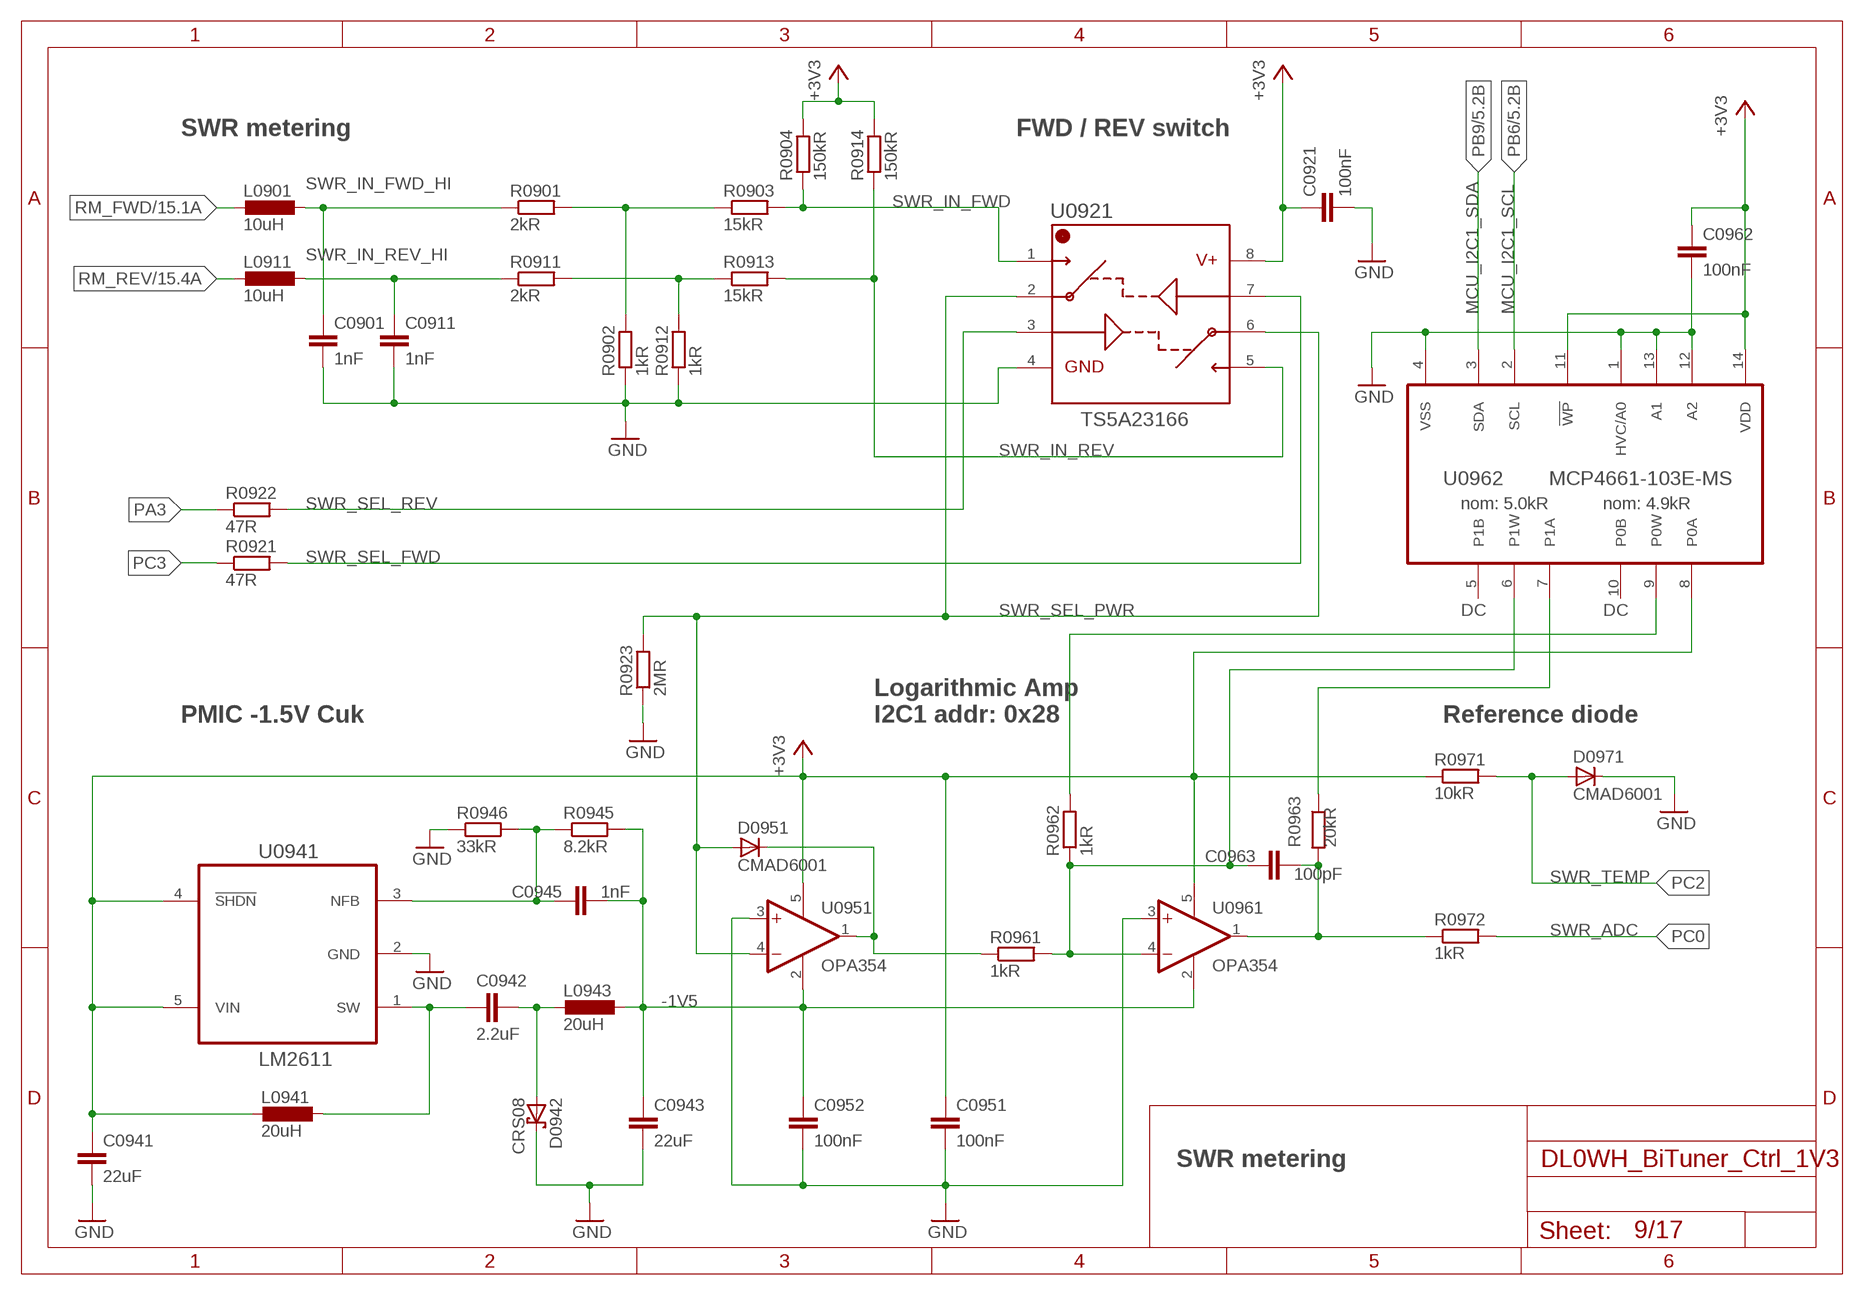
[diagram p8: schematic, sheet 9]

### Parts
C0901  1nF  C-EUC0402  [C0402]
C0911  1nF  C-EUC0402  [C0402]
C0921  100nF  C-EUC0402  [C0402]
C0941  22uF  C-EUC0603  [C0603]
C0942  2.2uF  C-EUC0603  [C0603]
C0943  22uF  C-EUC0603  [C0603]
C0945  1nF  C-EUC0402  [C0402]
C0951  100nF  C-EUC0402  [C0402]
C0952  100nF  C-EUC0402  [C0402]
C0962  100nF  C-EUC0402  [C0402]
C0963  100pF  C-EUC0402  [C0402]
D0942  CRS08  [SOD80C]
D0951  CMAD6001  D_SOD923  [SOD923]
D0971  CMAD6001  D_SOD923  [SOD923]
L0901  10uH  L-EUL0603  [L0603]
L0911  10uH  L-EUL0603  [L0603]
L0941  20uH  L-EUL1812  [L1812]
L0943  20uH  L-EUL1812  [L1812]
R0901  2kR  R-EU_R0402  [R0402]
R0902  1kR  R-EU_R0402  [R0402]
R0903  15kR  R-EU_R0402  [R0402]
R0904  150kR  R-EU_R0402  [R0402]
R0911  2kR  R-EU_R0402  [R0402]
R0912  1kR  R-EU_R0402  [R0402]
R0913  15kR  R-EU_R0402  [R0402]
R0914  150kR  R-EU_R0402  [R0402]
R0921  47R  R-EU_R0402  [R0402]
R0922  47R  R-EU_R0402  [R0402]
R0923  2MR  R-EU_R0402  [R0402]
R0945  8.2kR  R-EU_R0402  [R0402]
R0946  33kR  R-EU_R0402  [R0402]
R0961  1kR  R-EU_R0402  [R0402]
R0962  1kR  R-EU_R0402  [R0402]
R0963  20kR  R-EU_R0402  [R0402]
R0971  10kR  R-EU_R0402  [R0402]
R0972  1kR  R-EU_R0402  [R0402]
U0921  TS5A23166  [R-PDSO-G8]
U0941  LM2611  [SOT95P280X145-5N]
U0951  OPA354  [SOT-23-5]
U0961  OPA354  [SOT-23-5]
U0962  MCP4661-103E-MS  MCP4661-104E-MS  [TSSOP14]

### Nets
+3V3: C0921.1 C0941.1 C0951.1 C0962.1 L0941.2 R0904.2 R0914.2 R0971.1 U0921.8 U0941.4(!SHDN) U0941.5(VIN) U0951.5(V+) U0961.5(V+) U0962.8(P0A) U0962.11(!WP) U0962.14(VDD) ; also sheet 2,4,5,6,7,8,13
-1V5: C0943.1 C0945.2 C0952.1 L0943.1 R0945.2 U0951.2(V-) U0961.2(V-)
GND: C0901.2 C0911.2 C0921.2 C0941.2 C0943.2 C0951.2 C0952.2 C0962.2 D0942.C D0971.C R0902.1 R0912.1 R0923.1 R0946.1 U0921.4 U0941.2(GND) U0951.3(+IN) U0961.3(+IN) U0962.1(HVC/A0) U0962.4(VSS) U0962.12(A2) U0962.13(A1) ; also sheet 1,2,3,4,5,6,7,8,10,11,12,13,14,15,17
LM2611_NFB: C0945.1 R0945.1 R0946.2 U0941.3(NFB)
LM2611_SW: C0942.1 L0941.1 U0941.1(SW)
LM_DA: C0942.2 D0942.A L0943.2
OPA_FB: R0963.1 U0962.7(P1A)
OPA_PULL: R0962.2 U0962.9(P0W)
PA3: R0922.1 ; also sheet 1
PB6: U0962.2(SCL) ; also sheet 1,5
PB9: U0962.3(SDA) ; also sheet 1,5
PC0 [mil6_nofill]: R0972.2 ; also sheet 1
PC2 [mil6_nofill]: D0971.A R0971.2 ; also sheet 1
PC3: R0921.1 ; also sheet 1
RM_FWD: L0901.2 ; also sheet 15
RM_REV: L0911.2 ; also sheet 15
SWR_IN_FWD: R0903.2 R0904.1 U0921.1
SWR_IN_FWD_HI: C0901.1 L0901.1 R0901.1
SWR_IN_FWD_LO: R0901.2 R0902.2 R0903.1
SWR_IN_REV: R0913.2 R0914.1 U0921.5
SWR_IN_REV_HI: C0911.1 L0911.1 R0911.1
SWR_IN_REV_LO: R0911.2 R0912.2 R0913.1
SWR_OP1_OUT: D0951.C R0961.1 U0951.1(OUT)
SWR_OP2_IN: C0963.1 R0961.2 R0962.1 U0961.4(-IN) U0962.6(P1W)
SWR_OP2_OUT: C0963.2 R0963.2 R0972.1 U0961.1(OUT)
SWR_SEL_FWD [mil6_nofill]: R0921.2 U0921.7
SWR_SEL_PWR: D0951.A R0923.2 U0921.2 U0921.6 U0951.4(-IN)
SWR_SEL_REV [mil6_nofill]: R0922.2 U0921.3
Unconnected: U0962.5(P1B) U0962.10(P0B)

### Notes on the sheet
- SWR metering | FWD / REV switch
- MCU_I2C1_SDA | MCU_I2C1_SCL
- nom: 5.0kR | nom: 4.9kR
- DC | DC
- PMIC -1.5V Cuk
- Logarithmic Amp
  I2C1 addr: 0x28
- Reference diode
- SWR_TEMP
- SWR_ADC
- SWR metering

## Sheet 10 of 17: RS232 command IF
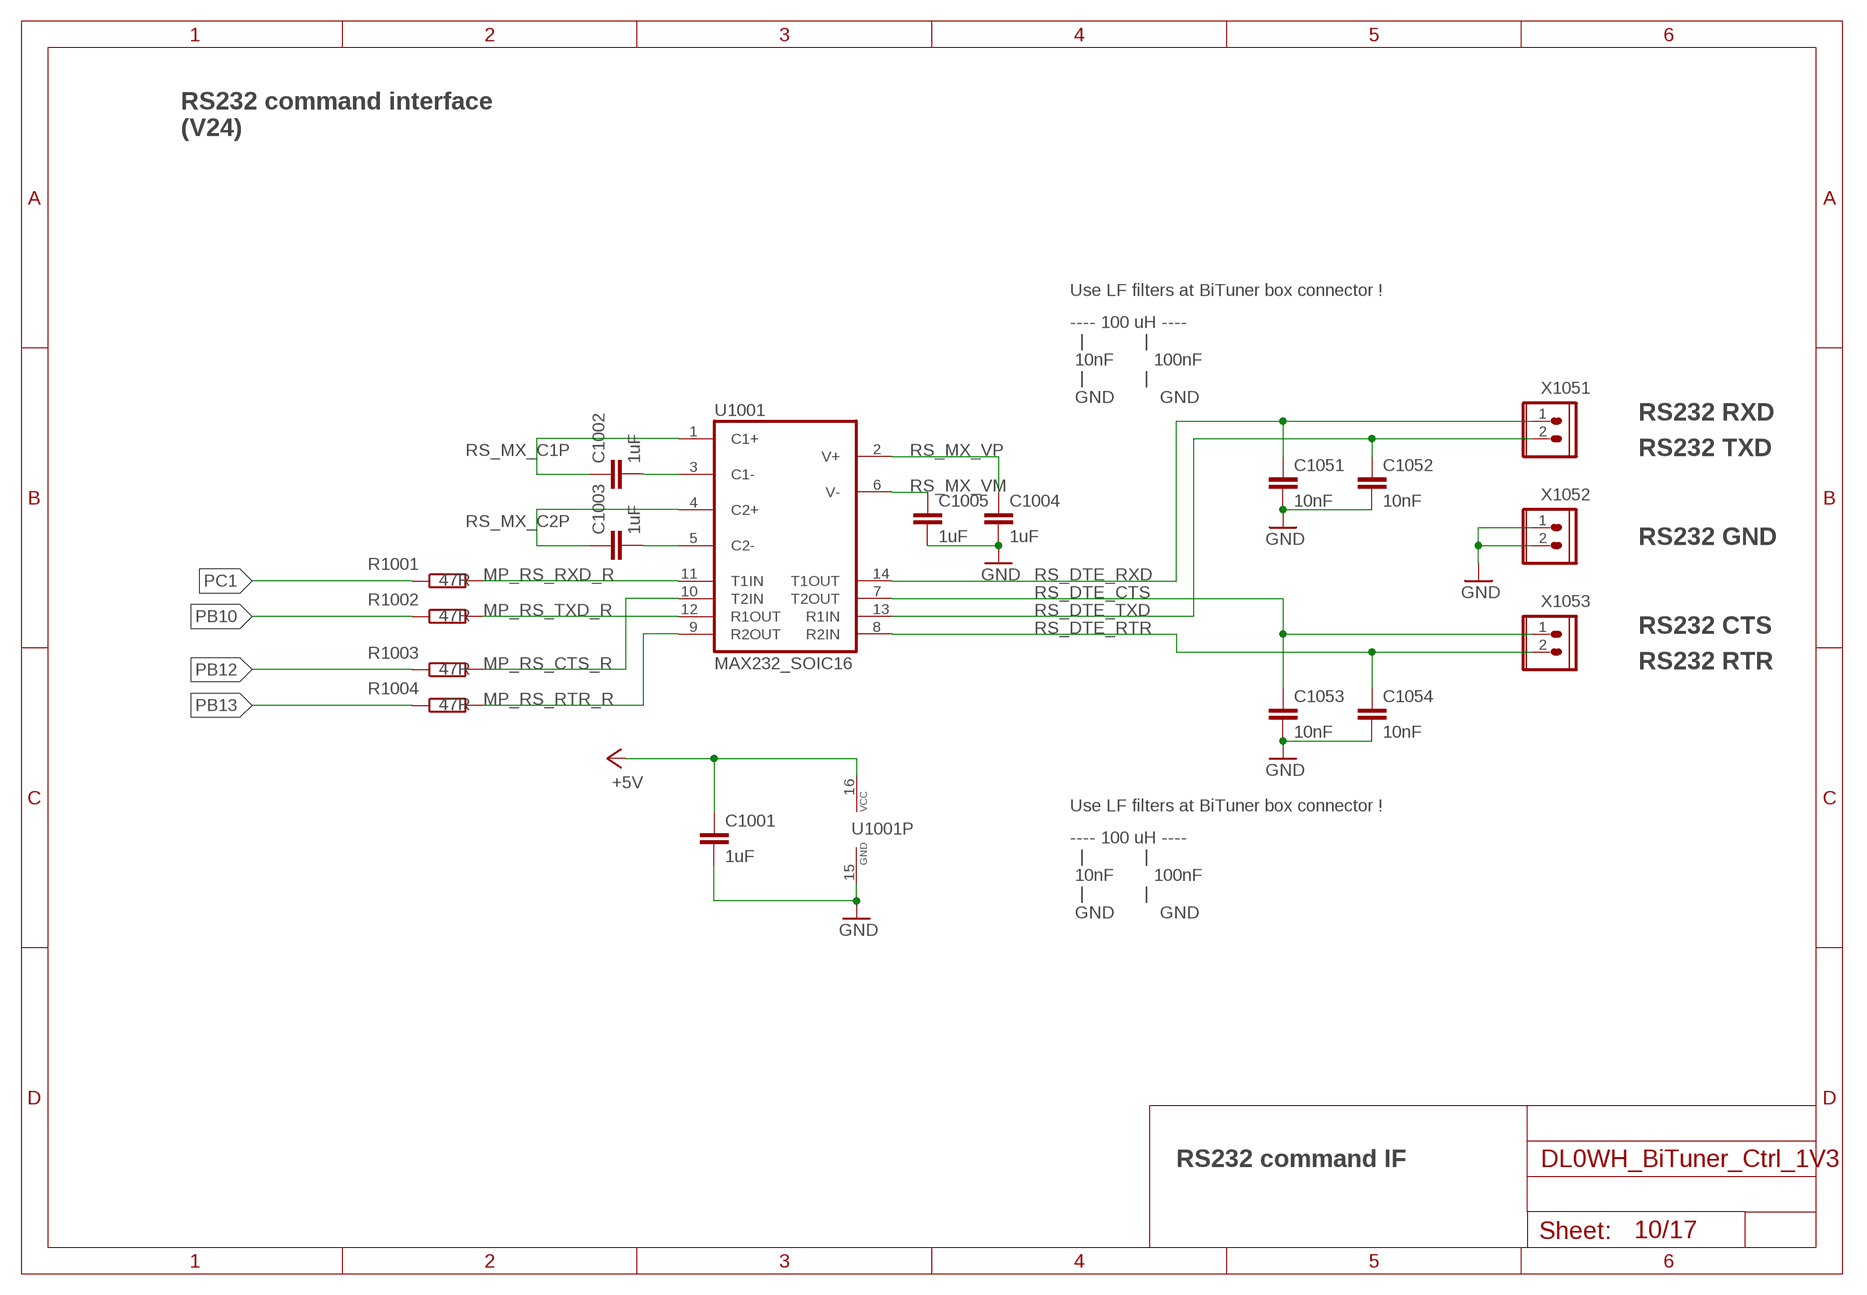
[diagram p9: schematic, sheet 10]

### Parts
C1001  1uF  C-EUC0402  [C0402]
C1002  1uF  C-EUC0402  [C0402]
C1003  1uF  C-EUC0402  [C0402]
C1004  1uF  C-EUC0402  [C0402]
C1005  1uF  C-EUC0402  [C0402]
C1051  10nF  C-EUC0402  [C0402]
C1052  10nF  C-EUC0402  [C0402]
C1053  10nF  C-EUC0402  [C0402]
C1054  10nF  C-EUC0402  [C0402]
R1001  47R  R-EU_R0402  [R0402]
R1002  47R  R-EU_R0402  [R0402]
R1003  47R  R-EU_R0402  [R0402]
R1004  47R  R-EU_R0402  [R0402]
U1001  MAX232_SOIC16  [SOIC16N]
X1051  WIRE-TO-BOARD_5MM08_1X02  [WIRE-TO-BOARD_5MM08_1X02]
X1052  WIRE-TO-BOARD_5MM08_1X02  [WIRE-TO-BOARD_5MM08_1X02]
X1053  WIRE-TO-BOARD_5MM08_1X02  [WIRE-TO-BOARD_5MM08_1X02]

### Nets
+5V: C1001.1 U1001.16(VCC) ; also sheet 11,12,13
GND: C1001.2 C1004.2 C1005.2 C1051.2 C1052.2 C1053.2 C1054.2 U1001.15(GND) X1052.1 X1052.2 ; also sheet 1,2,3,4,5,6,7,8,9,11,12,13,14,15,17
MP_RS_CTS_R [mil6_nofill]: R1003.2 U1001.10(T2IN)
MP_RS_RTR_R: R1004.2 U1001.9(R2OUT)
MP_RS_RXD_R [mil6_nofill]: R1001.2 U1001.11(T1IN)
MP_RS_TXD_R: R1002.2 U1001.12(R1OUT)
PB10 [mil6_nofill]: R1002.1 ; also sheet 1
PB12: R1003.1 ; also sheet 1
PB13 [mil6_nofill]: R1004.1 ; also sheet 1
PC1: R1001.1 ; also sheet 1
RS_DTE_CTS: C1053.1 U1001.7(T2OUT) X1053.1
RS_DTE_RTR: C1054.1 U1001.8(R2IN) X1053.2
RS_DTE_RXD: C1051.1 U1001.14(T1OUT) X1051.1
RS_DTE_TXD: C1052.1 U1001.13(R1IN) X1051.2
RS_MX_C1N1: C1002.2 U1001.3(C1-)
RS_MX_C1P: C1002.1 U1001.1(C1+)
RS_MX_C2M1: C1003.2 U1001.5(C2-)
RS_MX_C2P: C1003.1 U1001.4(C2+)
RS_MX_VM: C1005.1 U1001.6(V-)
RS_MX_VP: C1004.1 U1001.2(V+)

### Notes on the sheet
- RS232 command interface
  (V24)
- Use LF filters at BiTuner box connector !
- ---- 100 uH ----
    |            |
   10nF        100nF
    |            |
   GND         GND
- RS232 RXD
- RS232 TXD
- RS232 GND
- RS232 CTS
- RS232 RTR
- Use LF filters at BiTuner box connector !
- ---- 100 uH ----
    |            |
   10nF        100nF
    |            |
   GND         GND
- RS232 command IF

## Sheet 11 of 17: CAT interface
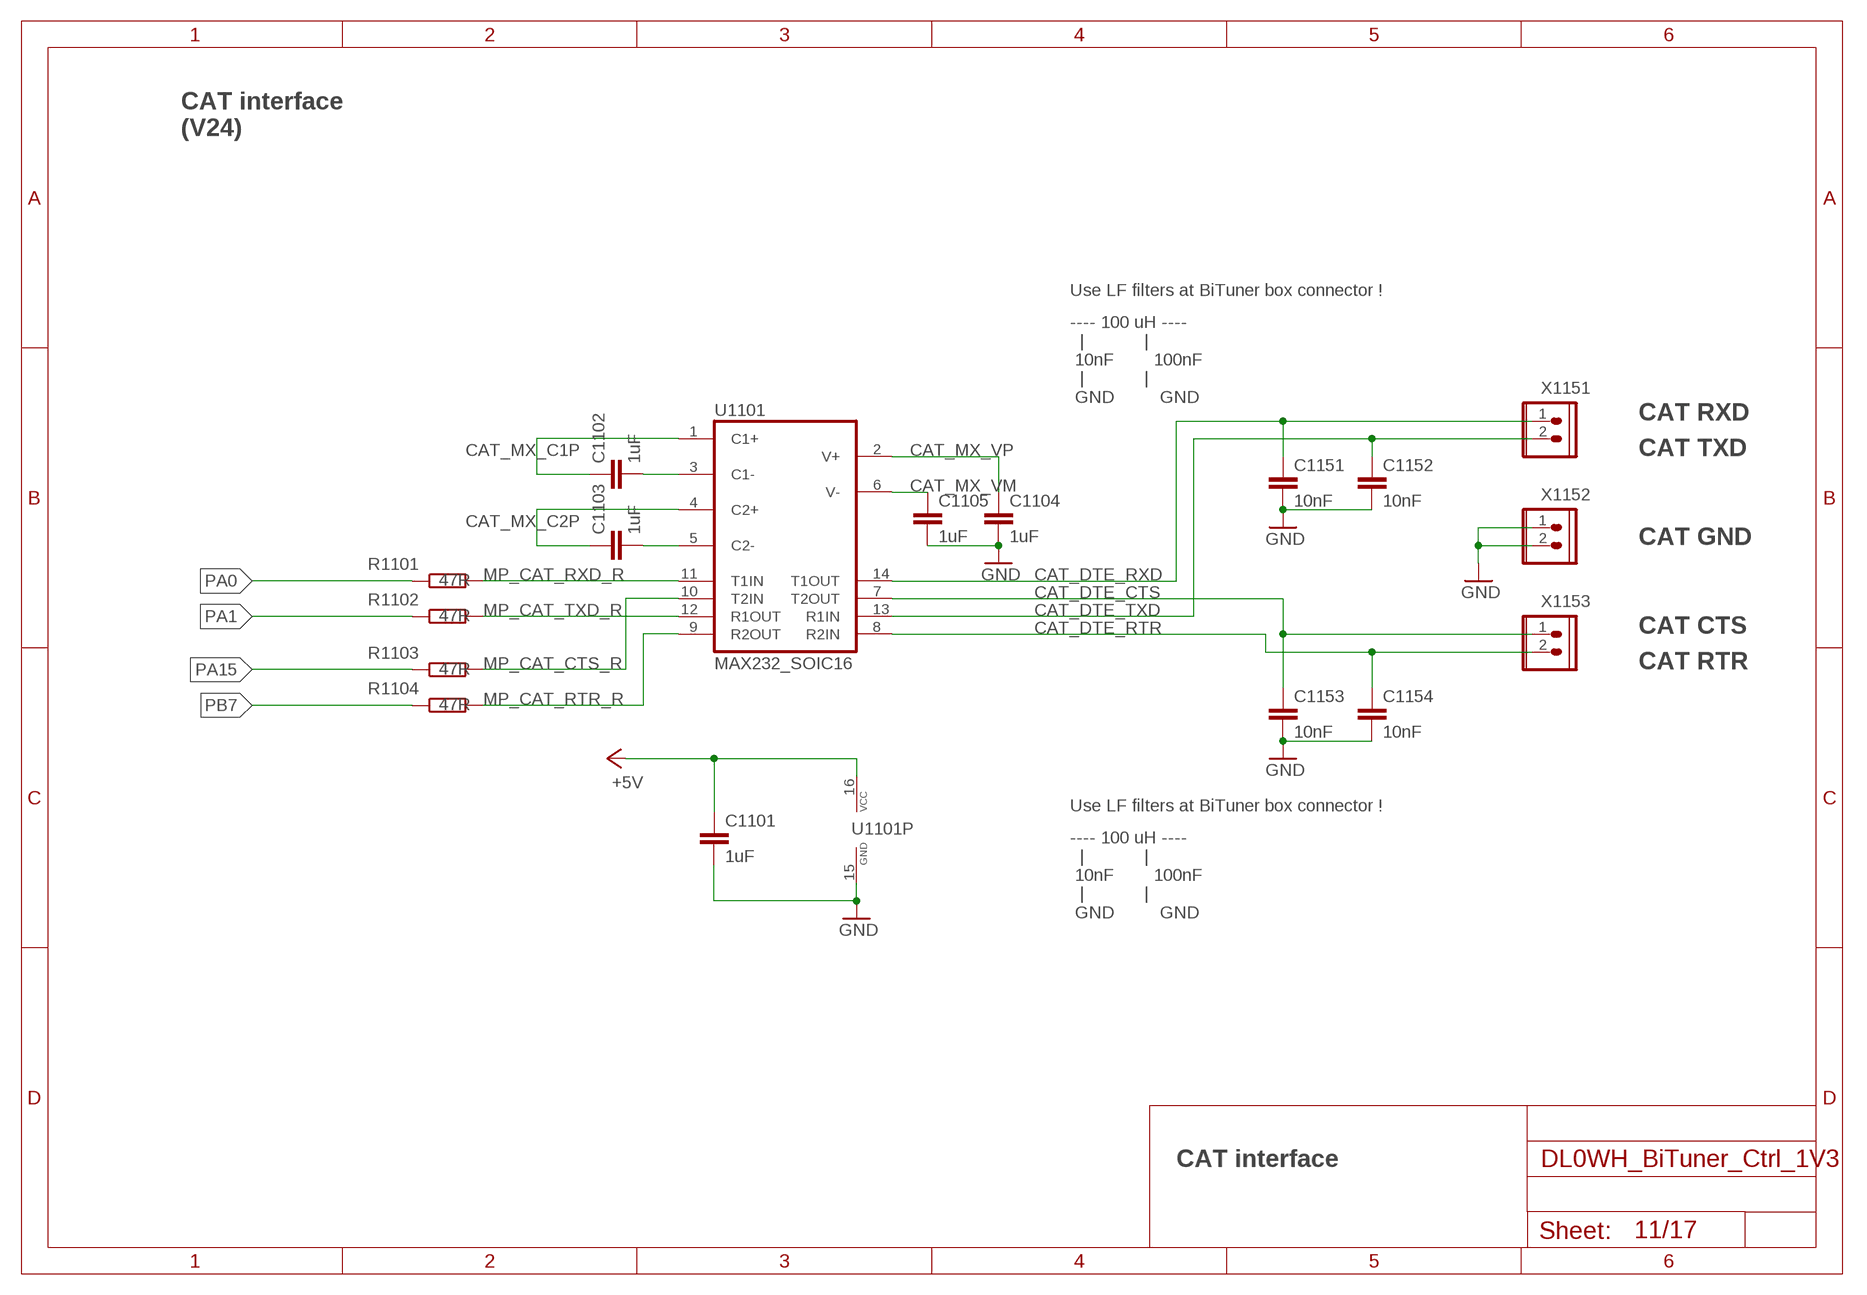
[diagram p10: schematic, sheet 11]

### Parts
C1101  1uF  C-EUC0402  [C0402]
C1102  1uF  C-EUC0402  [C0402]
C1103  1uF  C-EUC0402  [C0402]
C1104  1uF  C-EUC0402  [C0402]
C1105  1uF  C-EUC0402  [C0402]
C1151  10nF  C-EUC0402  [C0402]
C1152  10nF  C-EUC0402  [C0402]
C1153  10nF  C-EUC0402  [C0402]
C1154  10nF  C-EUC0402  [C0402]
R1101  47R  R-EU_R0402  [R0402]
R1102  47R  R-EU_R0402  [R0402]
R1103  47R  R-EU_R0402  [R0402]
R1104  47R  R-EU_R0402  [R0402]
U1101  MAX232_SOIC16  [SOIC16N]
X1151  WIRE-TO-BOARD_5MM08_1X02  [WIRE-TO-BOARD_5MM08_1X02]
X1152  WIRE-TO-BOARD_5MM08_1X02  [WIRE-TO-BOARD_5MM08_1X02]
X1153  WIRE-TO-BOARD_5MM08_1X02  [WIRE-TO-BOARD_5MM08_1X02]

### Nets
+5V: C1101.1 U1101.16(VCC) ; also sheet 10,12,13
CAT_DTE_CTS: C1153.1 U1101.7(T2OUT) X1153.1
CAT_DTE_RTR: C1154.1 U1101.8(R2IN) X1153.2
CAT_DTE_RXD: C1151.1 U1101.14(T1OUT) X1151.1
CAT_DTE_TXD: C1152.1 U1101.13(R1IN) X1151.2
CAT_MX_C1N: C1102.2 U1101.3(C1-)
CAT_MX_C1P: C1102.1 U1101.1(C1+)
CAT_MX_C2M: C1103.2 U1101.5(C2-)
CAT_MX_C2P: C1103.1 U1101.4(C2+)
CAT_MX_VM: C1105.1 U1101.6(V-)
CAT_MX_VP: C1104.1 U1101.2(V+)
GND: C1101.2 C1104.2 C1105.2 C1151.2 C1152.2 C1153.2 C1154.2 U1101.15(GND) X1152.1 X1152.2 ; also sheet 1,2,3,4,5,6,7,8,9,10,12,13,14,15,17
MP_CAT_CTS_R: R1103.2 U1101.10(T2IN)
MP_CAT_RTR_R: R1104.2 U1101.9(R2OUT)
MP_CAT_RXD_R: R1101.2 U1101.11(T1IN)
MP_CAT_TXD_R: R1102.2 U1101.12(R1OUT)
PA0: R1101.1 ; also sheet 1
PA1: R1102.1 ; also sheet 1
PA15: R1103.1 ; also sheet 1
PB7: R1104.1 ; also sheet 1

### Notes on the sheet
- CAT interface
  (V24)
- Use LF filters at BiTuner box connector !
- ---- 100 uH ----
    |            |
   10nF        100nF
    |            |
   GND         GND
- CAT RXD
- CAT TXD
- CAT GND
- CAT CTS
- CAT RTR
- Use LF filters at BiTuner box connector !
- ---- 100 uH ----
    |            |
   10nF        100nF
    |            |
   GND         GND
- CAT interface

## Sheet 12 of 17: PMIC 12V --> 5V0
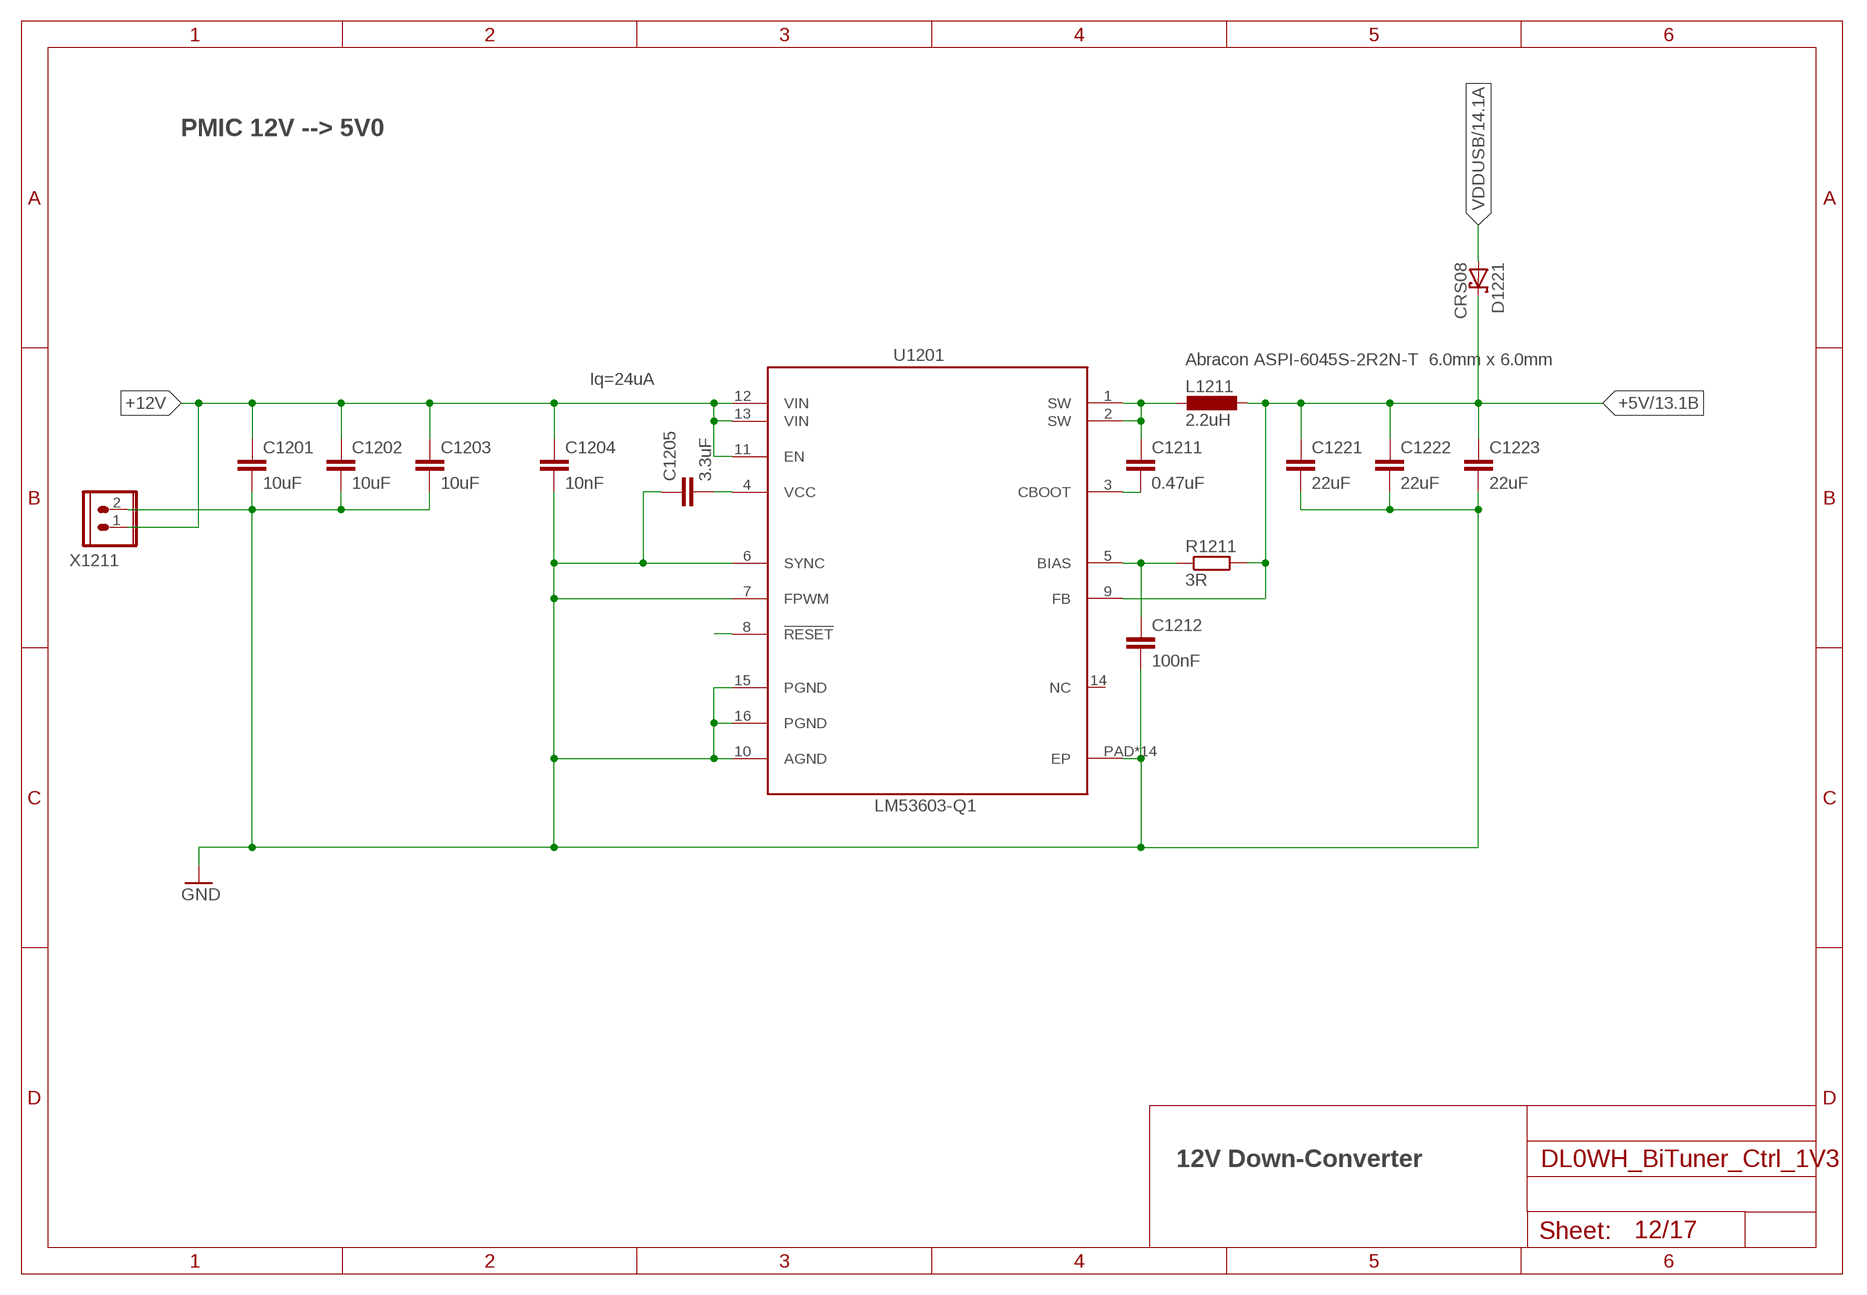
[diagram p11: schematic, sheet 12]

### Parts
C1201  10uF  C-EUC0603  [C0603]
C1202  10uF  C-EUC0603  [C0603]
C1203  10uF  C-EUC0603  [C0603]
C1204  10nF  C-EUC0402  [C0402]
C1205  3.3uF  C-EUC0603  [C0603]
C1211  0.47uF  C-EUC0402  [C0402]
C1212  100nF  C-EUC0402  [C0402]
C1221  22uF  C-EUC0603  [C0603]
C1222  22uF  C-EUC0603  [C0603]
C1223  22uF  C-EUC0603  [C0603]
D1221  CRS08  [SOD80C]
L1211  2.2uH  L-EU6.00X6.00MM  [L_6.00MM_X_6.00MM]
R1211  3R  R-EU_R0402  [R0402]
U1201  LM53603-Q1  [HTSSOP16]
X1211  WIRE-TO-BOARD_5MM08_1X02  [WIRE-TO-BOARD_5MM08_1X02]

### Nets
+5V: C1221.1 C1222.1 C1223.1 D1221.C L1211.1 R1211.2 U1201.9(FB) ; also sheet 10,11,13
+12V: C1201.1 C1202.1 C1203.1 C1204.1 U1201.11(EN) U1201.12(VIN) U1201.13(VIN) X1211.1 ; also sheet 6,7,8,16
GND: C1201.2 C1202.2 C1203.2 C1204.2 C1205.1 C1212.2 C1221.2 C1222.2 C1223.2 U1201.6(SYNC) U1201.7(FPWM) U1201.10(AGND) U1201.15(PGND) U1201.16(PGND) U1201.PAD1(EP) U1201.PAD2(EP) U1201.PAD3(EP) U1201.PAD4(EP) U1201.PAD5(EP) U1201.PAD6(EP) U1201.PAD7(EP) U1201.PAD8(EP) U1201.PAD9(EP) U1201.PAD10(EP) U1201.PAD11(EP) U1201.PAD12(EP) U1201.PAD13(EP) U1201.PAD(EP) X1211.2 ; also sheet 1,2,3,4,5,6,7,8,9,10,11,13,14,15,17
LM53603_!RESET: U1201.8(!RESET)
LM53603_BIAS: C1212.1 R1211.1 U1201.5(BIAS)
LM53603_CBOOT: C1211.2 U1201.3(CBOOT)
LM53603_SW: C1211.1 L1211.2 U1201.1(SW) U1201.2(SW)
LM53603_VCC: C1205.2 U1201.4(VCC)
VDDUSB: D1221.A ; also sheet 1,14
Unconnected: U1201.14(NC)

### Notes on the sheet
- PMIC 12V --> 5V0
- Abracon ASPI-6045S-2R2N-T  6.0mm x 6.0mm
- Iq=24uA
- 12V Down-Converter

## Sheet 13 of 17: PMIC 5V --> 3V3
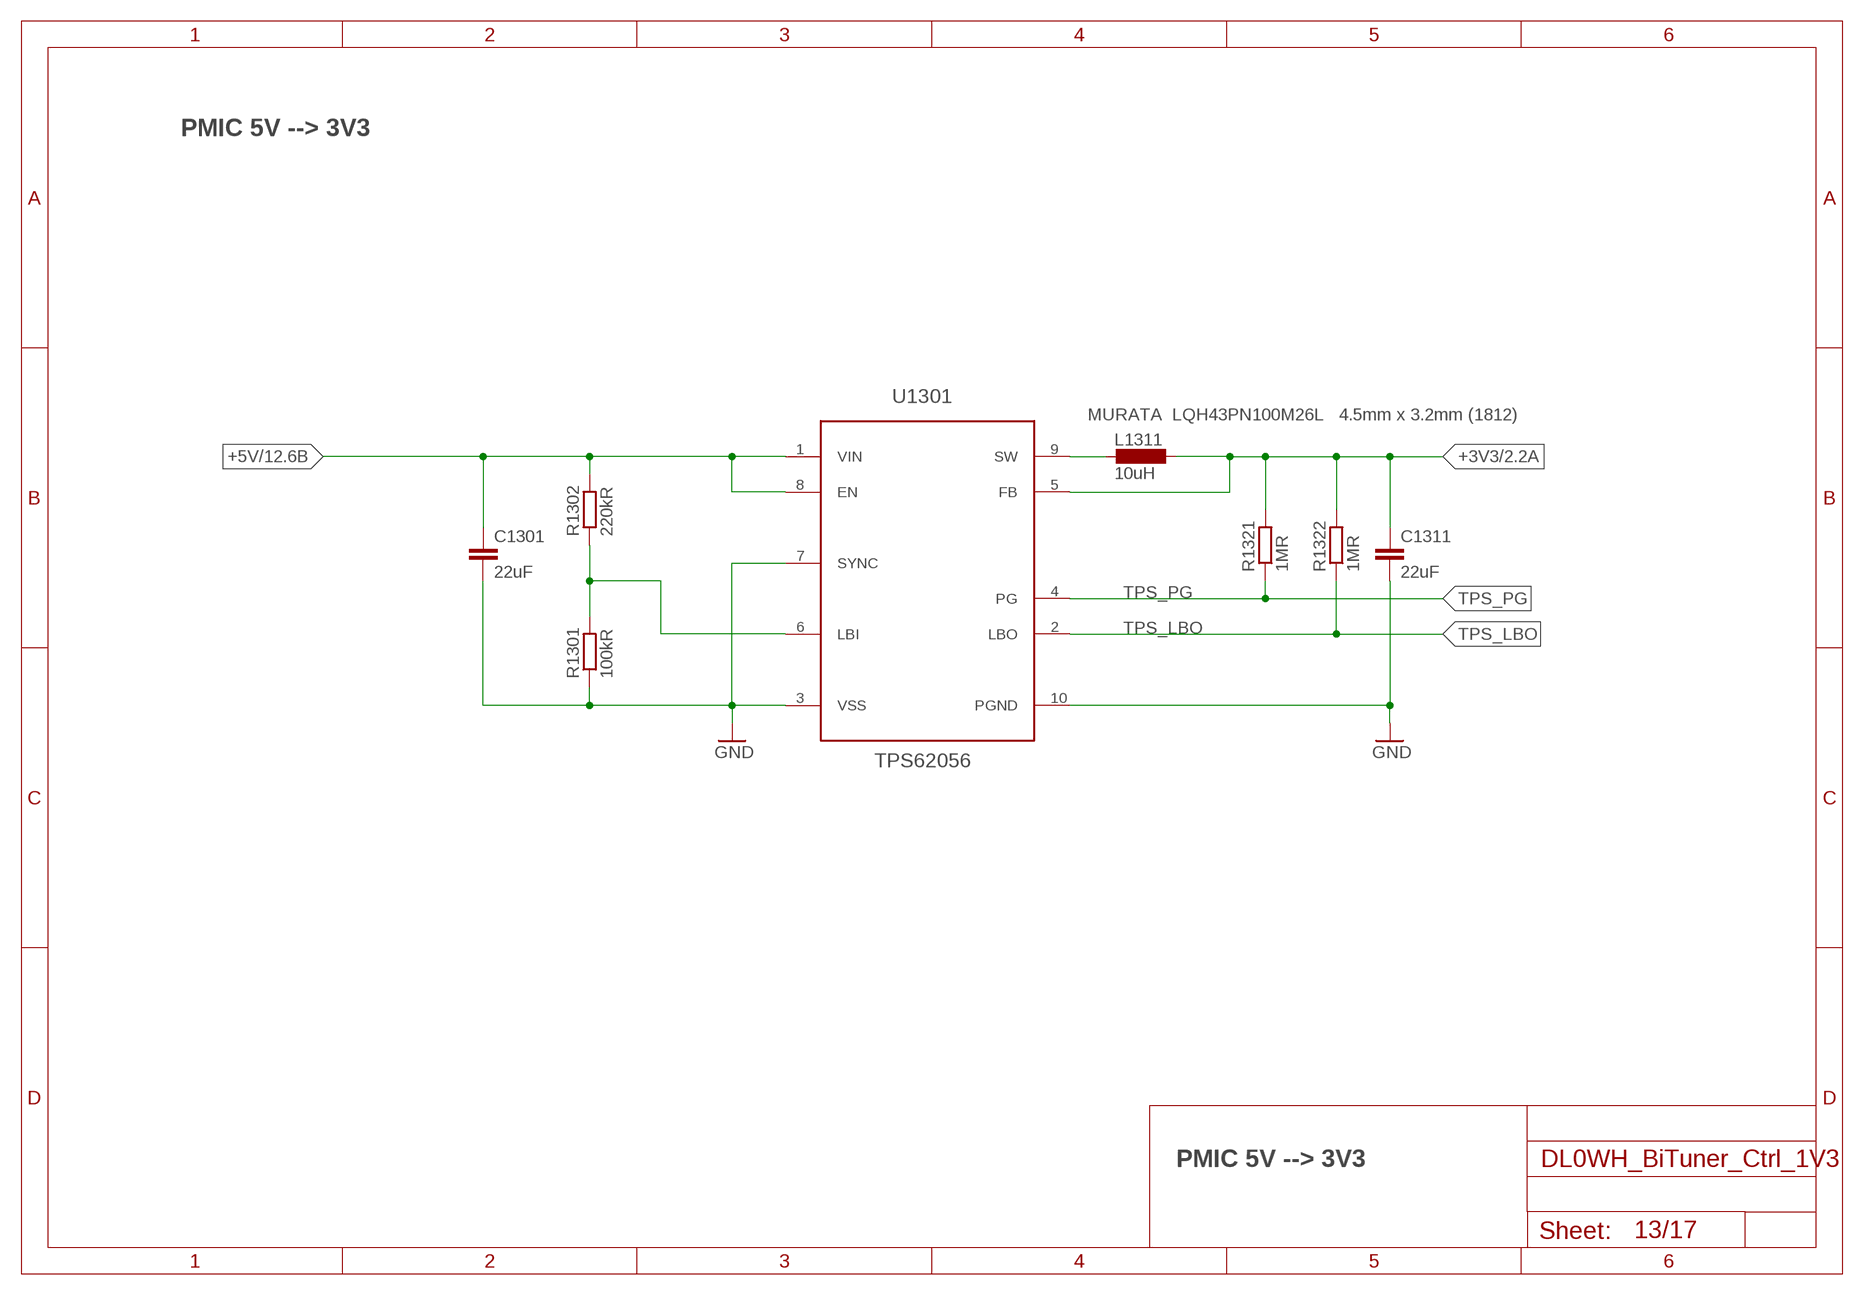
[diagram p12: schematic, sheet 13]

### Parts
C1301  22uF  C-EUC0603  [C0603]
C1311  22uF  C-EUC0603  [C0603]
L1311  10uH  L-EU4.50X3.20MM  [L_4.50MM_X_3.20MM]
R1301  100kR  R-EU_R0402  [R0402]
R1302  220kR  R-EU_R0402  [R0402]
R1321  1MR  R-EU_R0402  [R0402]
R1322  1MR  R-EU_R0402  [R0402]
U1301  TPS62056  TPS62051  [S-PDSO-G10]

### Nets
+3V3: C1311.1 L1311.1 L1311.3 R1321.2 R1322.2 U1301.5(FB) ; also sheet 2,4,5,6,7,8,9
+5V: C1301.1 R1302.2 U1301.1(VIN) U1301.8(EN) ; also sheet 10,11,12
GND: C1301.2 C1311.2 R1301.1 U1301.3(VSS) U1301.7(SYNC) U1301.10(PGND) ; also sheet 1,2,3,4,5,6,7,8,9,10,11,12,14,15,17
TPS_LBI: R1301.2 R1302.1 U1301.6(LBI)
TPS_LBO: R1322.1 U1301.2(LBO)
TPS_PG: R1321.1 U1301.4(PG)
TPS_SW: L1311.2 L1311.4 U1301.9(SW)

### Notes on the sheet
- PMIC 5V --> 3V3
- MURATA  LQH43PN100M26L   4.5mm x 3.2mm (1812)
- TPS_PG
- TPS_LBO
- PMIC 5V --> 3V3

## Sheet 14 of 17: USB Jack
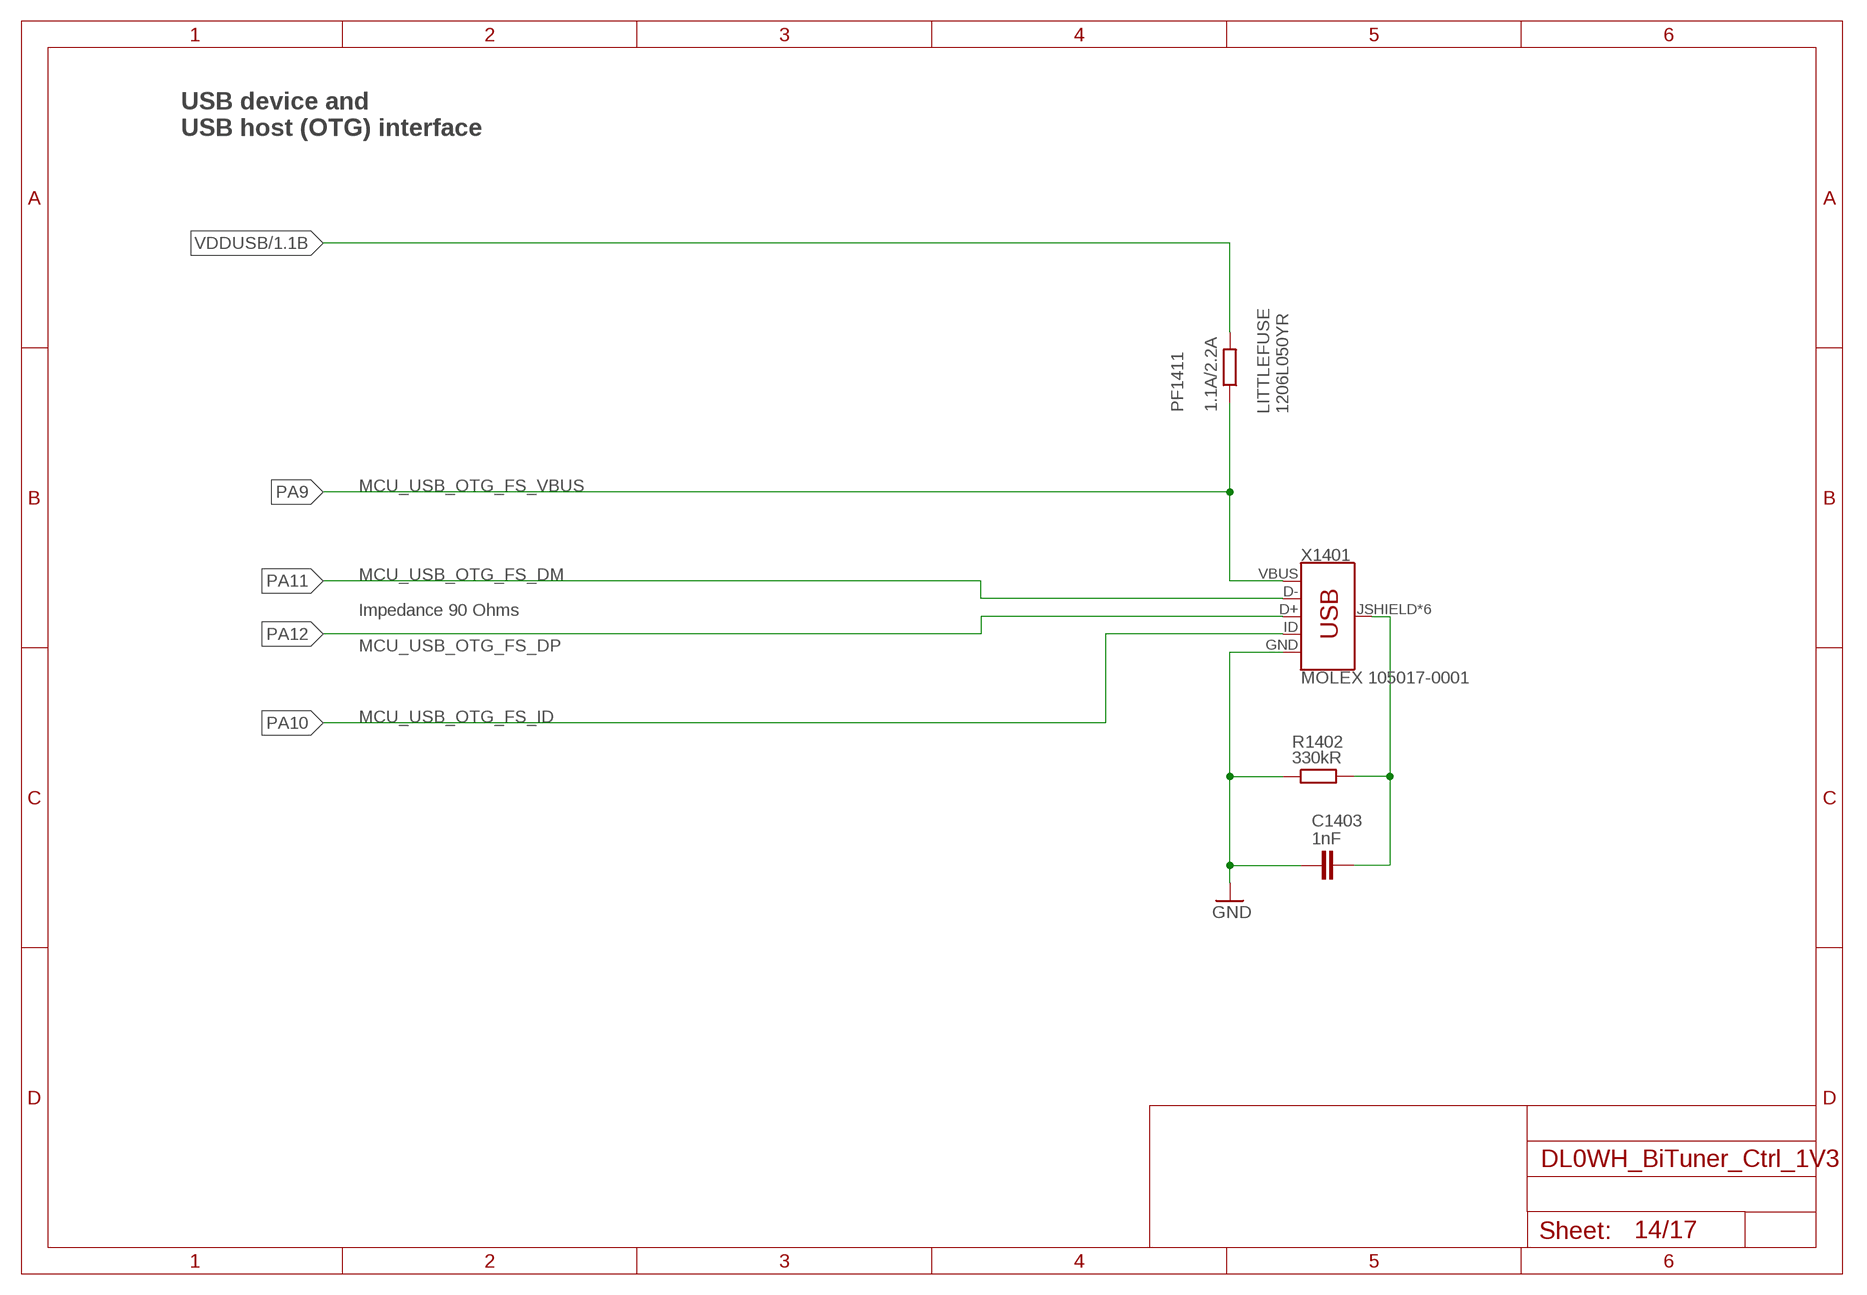
[diagram p13: schematic, sheet 14]

### Parts
C1403  1nF  C-EUC0402  [C0402]
PF1411  1.1A/2.2A  R-EU_M1206  [M1206]
R1402  330kR  R-EU_R0402  [R0402]
X1401  MOLEX 105017-0001  USB_MICRO-B_MOLEX  [USB-B-MICRO-SMD_MOLEX-105017-0001]

### Nets
GND: C1403.1 R1402.1 X1401.GND ; also sheet 1,2,3,4,5,6,7,8,9,10,11,12,13,15,17
PA9: PF1411.1 X1401.VBUS(J_VUSB) ; also sheet 1
PA10: X1401.ID(J_ID) ; also sheet 1
PA11: X1401.D-(J_D-) ; also sheet 1
PA12: X1401.D+(J_D+) ; also sheet 1
USB_SHIELD: C1403.2 R1402.2 X1401.JSHIELD(SHIELD) X1401.JSHIELD@2(SHIELD) X1401.JSHIELD@3(SHIELD) X1401.JSHIELD@4(SHIELD) X1401.JSHIELD@5(SHIELD) X1401.JSHIELD@6(SHIELD)
VDDUSB: PF1411.2 ; also sheet 1,12

### Notes on the sheet
- USB device and
  USB host (OTG) interface
- LITTLEFUSE
  1206L050YR
- MCU_USB_OTG_FS_VBUS
- MCU_USB_OTG_FS_DM
- Impedance 90 Ohms
- MCU_USB_OTG_FS_DP
- MCU_USB_OTG_FS_ID

## Sheet 15 of 17: SMA sockets
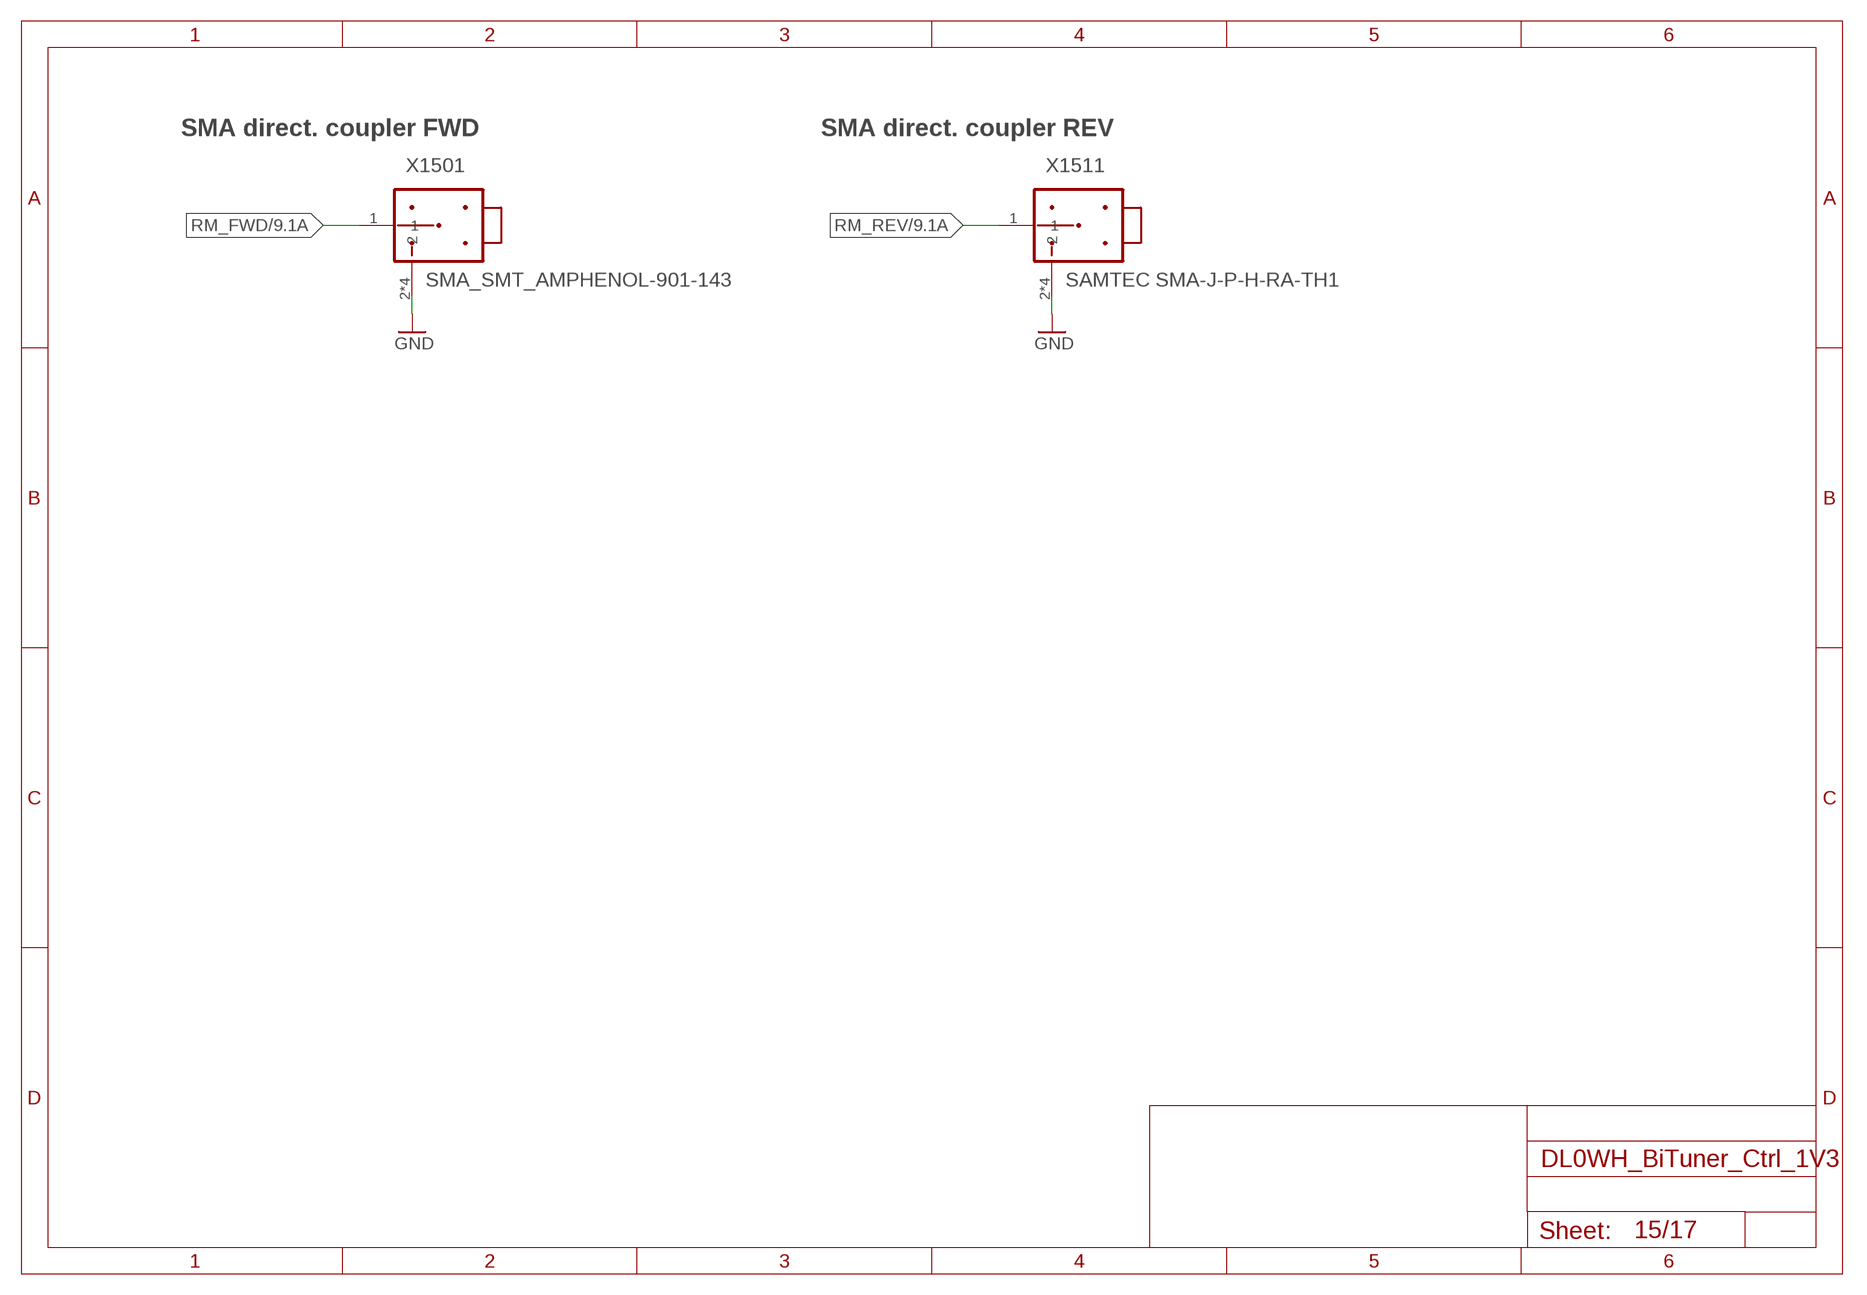
[diagram p14: schematic, sheet 15]

### Parts
X1501  SMA_SMT_AMPHENOL-901-143  [SMA_SMT_AMPHENOL_901-143]
X1511  SAMTEC SMA-J-P-H-RA-TH1  SMA_SMT_AMPHENOL-901-143  [SMA_SMT_AMPHENOL_901-143]

### Nets
GND: X1501.2 X1501.3 X1501.4 X1501.5 X1511.2 X1511.3 X1511.4 X1511.5 ; also sheet 1,2,3,4,5,6,7,8,9,10,11,12,13,14,17
RM_FWD: X1501.1 ; also sheet 9
RM_REV: X1511.1 ; also sheet 9

### Notes on the sheet
- SMA direct. coupler FWD | SMA direct. coupler REV

## Sheet 16 of 17: Relais Board Connectors
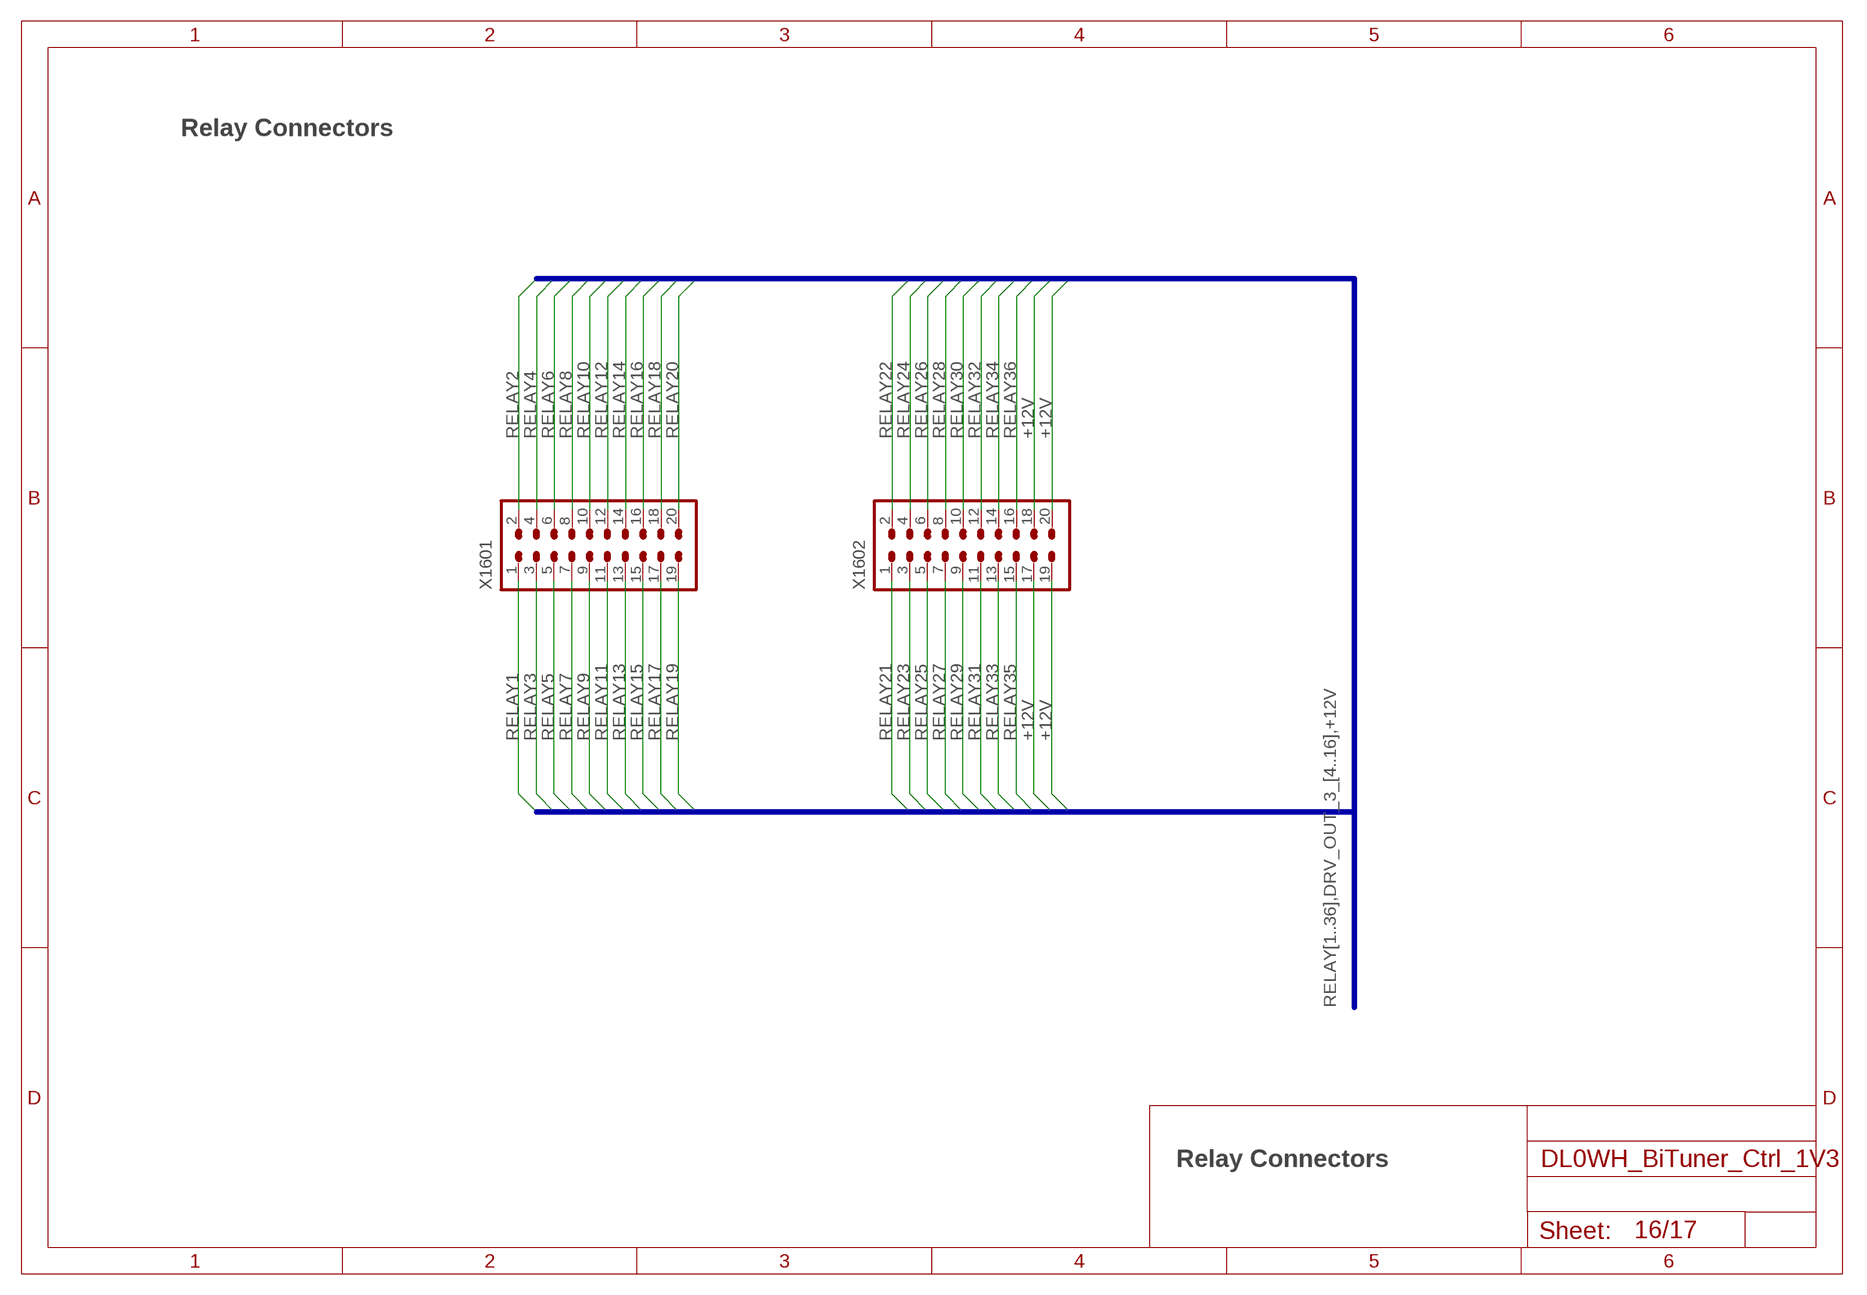
[diagram p15: schematic, sheet 16]

### Parts
X1601  2X10_2MM56_SOCKET  [2X10]
X1602  2X10_2MM56_SOCKET  [2X10]

### Nets
+12V: X1602.17 X1602.18 X1602.19 X1602.20 ; also sheet 6,7,8,12
RELAY1 [mil6_nofill]: X1601.1 ; also sheet 6
RELAY2 [mil6_nofill]: X1601.2 ; also sheet 6
RELAY3 [mil6_nofill]: X1601.3 ; also sheet 6
RELAY4 [mil6_nofill]: X1601.4 ; also sheet 6
RELAY5 [mil6_nofill]: X1601.5 ; also sheet 6
RELAY6 [mil6_nofill]: X1601.6 ; also sheet 6
RELAY7 [mil6_nofill]: X1601.7 ; also sheet 6
RELAY8 [mil6_nofill]: X1601.8 ; also sheet 6
RELAY9: X1601.9 ; also sheet 6
RELAY10 [mil6_nofill]: X1601.10 ; also sheet 6
RELAY11 [mil6_nofill]: X1601.11 ; also sheet 6
RELAY12 [mil6_nofill]: X1601.12 ; also sheet 6
RELAY13: X1601.13 ; also sheet 6
RELAY14: X1601.14 ; also sheet 6
RELAY15: X1601.15 ; also sheet 6
RELAY16 [mil6_nofill]: X1601.16 ; also sheet 6
RELAY17 [mil6_nofill]: X1601.17 ; also sheet 7
RELAY18 [mil6_nofill]: X1601.18 ; also sheet 7
RELAY19 [mil6_nofill]: X1601.19 ; also sheet 7
RELAY20 [mil6_nofill]: X1601.20 ; also sheet 7
RELAY21 [mil6_nofill]: X1602.1 ; also sheet 7
RELAY22 [mil6_nofill]: X1602.2 ; also sheet 7
RELAY23 [mil6_nofill]: X1602.3 ; also sheet 7
RELAY24 [mil6_nofill]: X1602.4 ; also sheet 7
RELAY25 [mil6_nofill]: X1602.5 ; also sheet 7
RELAY26 [mil6_nofill]: X1602.6 ; also sheet 7
RELAY27 [mil6_nofill]: X1602.7 ; also sheet 7
RELAY28 [mil6_nofill]: X1602.8 ; also sheet 7
RELAY29 [mil6_nofill]: X1602.9 ; also sheet 7
RELAY30 [mil6_nofill]: X1602.10 ; also sheet 7
RELAY31 [mil6_nofill]: X1602.11 ; also sheet 7
RELAY32 [mil6_nofill]: X1602.12 ; also sheet 7
RELAY33 [mil6_nofill]: X1602.13 ; also sheet 8
RELAY34 [mil6_nofill]: X1602.14 ; also sheet 8
RELAY35 [mil6_nofill]: X1602.15 ; also sheet 8
RELAY36 [mil6_nofill]: X1602.16 ; also sheet 8

### Buses
RELAY[1..36],DRV_OUT_3_[4..16],+12V

### Notes on the sheet
- Relay Connectors
- Relay Connectors

## Sheet 17 of 17: Mounting holes
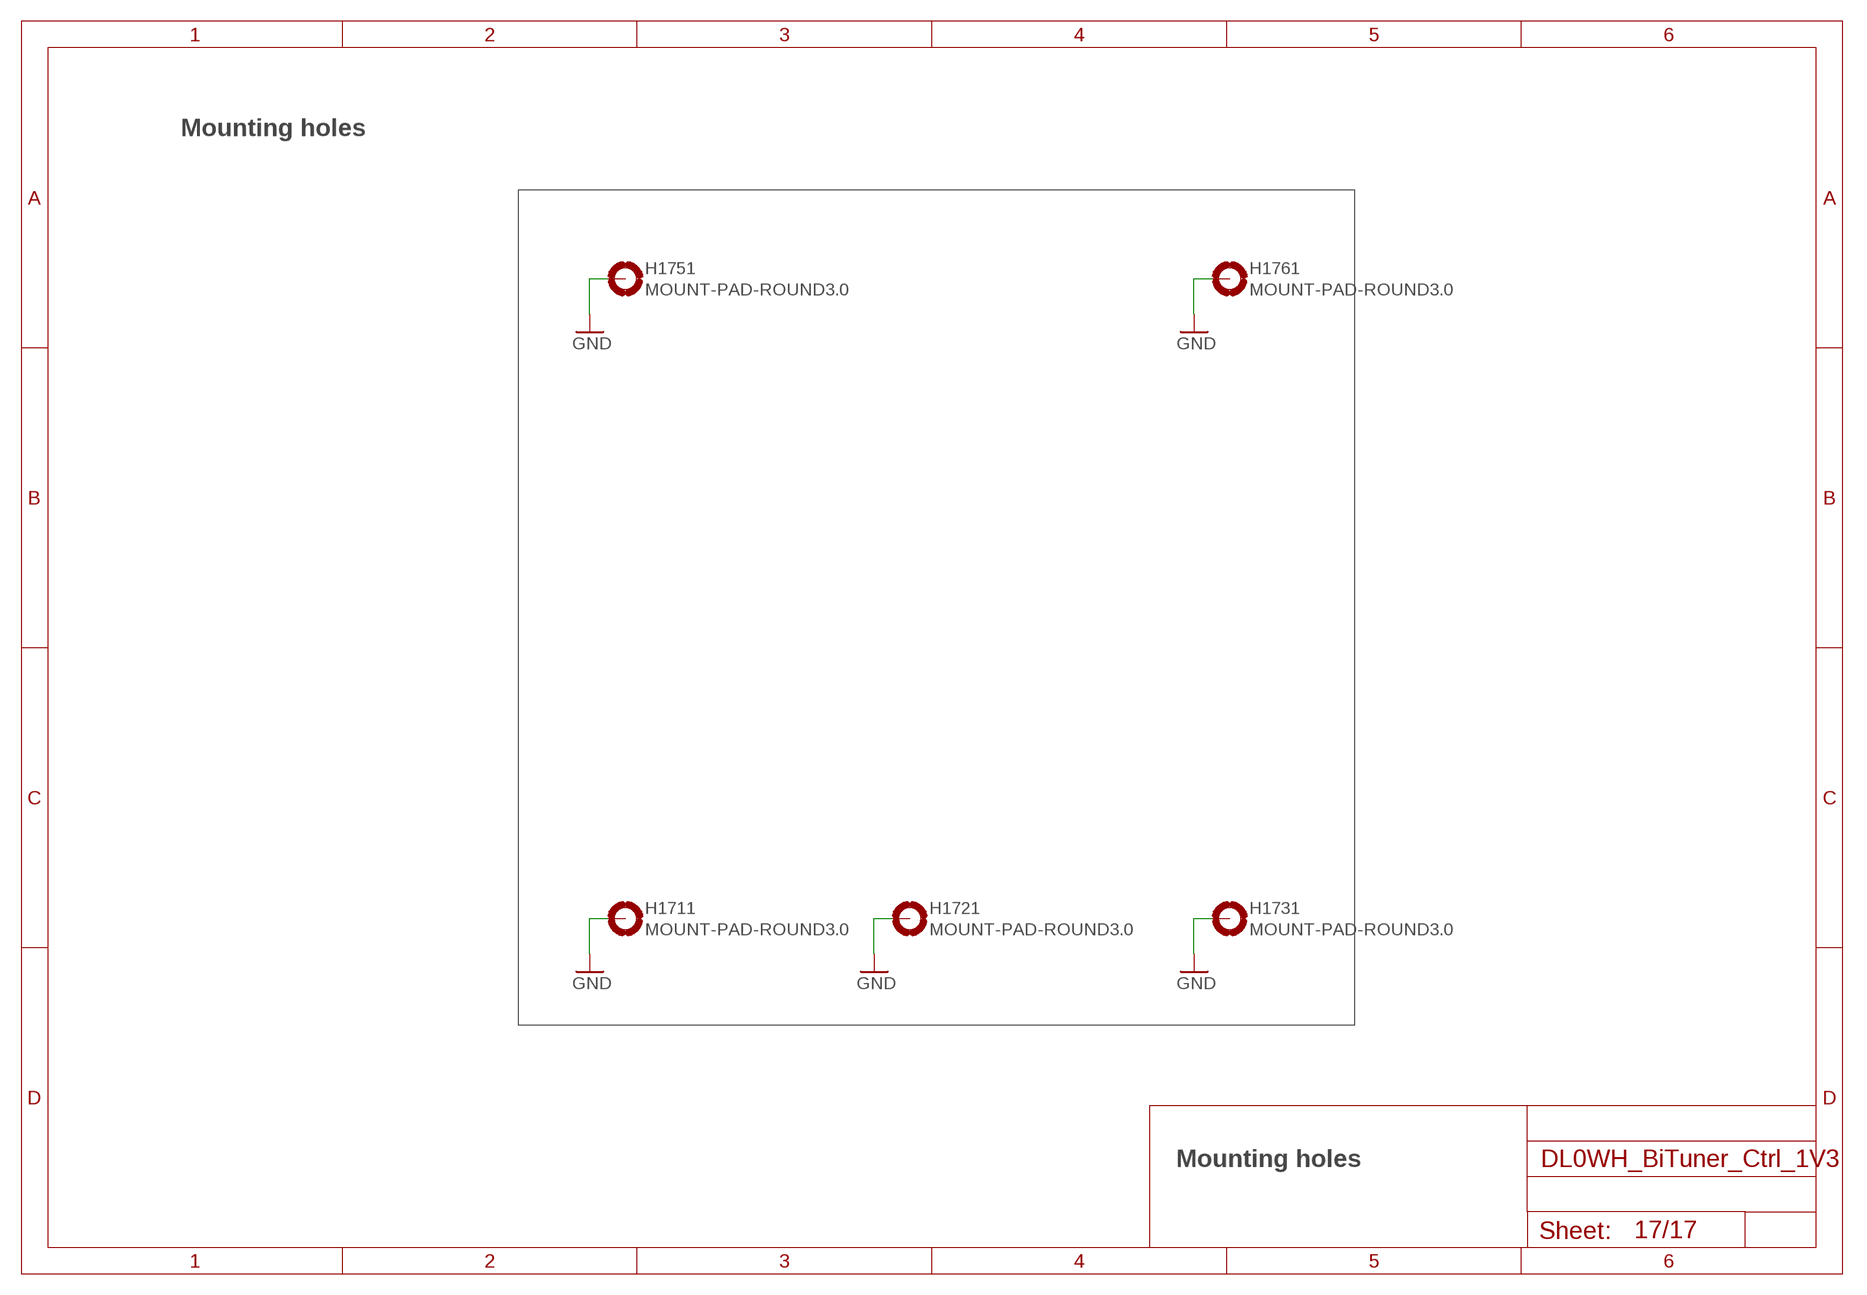
[diagram p16: schematic, sheet 17]

### Parts
H1711  MOUNT-PAD-ROUND3.0  [3,0-PAD]
H1721  MOUNT-PAD-ROUND3.0  [3,0-PAD]
H1731  MOUNT-PAD-ROUND3.0  [3,0-PAD]
H1751  MOUNT-PAD-ROUND3.0  [3,0-PAD]
H1761  MOUNT-PAD-ROUND3.0  [3,0-PAD]

### Nets
GND: H1711.B3,0(MOUNT) H1721.B3,0(MOUNT) H1731.B3,0(MOUNT) H1751.B3,0(MOUNT) H1761.B3,0(MOUNT) ; also sheet 1,2,3,4,5,6,7,8,9,10,11,12,13,14,15

### Notes on the sheet
- Mounting holes
- Mounting holes

## Library data of the parts
C0213 C0311 C0332 C0401-C0403 C0410 C0412 C0413 C0451 C0601-C0603 C0701-C0703 C0801-C0803 C0901 C0911 C0921 C0941-C0943 C0945 C0951 C0952 C0962 C0963 C1001-C1005 C1051-C1054 C1101-C1105 C1151-C1154 C1201-C1205 C1211 C1212 C1221-C1223 C1301 C1311 C1403 = df4iah_rcl:C-EU: CAPACITOR, European symbol
C0331 = df4iah_c-trimm:C-TRIMM: Trimm capacitor
D0942 D1221 = df4iah_diode:CRS08: SCHOTTKY BARRIER RECTIFIER
D0951 D0971 = df4iah_diode:D_SOD923: DIODE with SOD923 footprint
H1711 H1721 H1731 H1751 H1761 = df4iah_holes:MOUNT-PAD-ROUND: MOUNTING PAD, round
L0411 L0901 L0911 L0941 L0943 L1211 L1311 = df4iah_rcl:L-EU: INDUCTOR, European symbol
PF1411 = rcl:R-EU_: RESISTOR, European symbol
Q0321 = df4iah_crystal:ABS07-32.768KHZ: ABRACON ABS07 32.768 kHz SMD LOW PROFILE CRYSTAL Source: http://www.abracon.com/Resonators/ABS07.pdf; FARNELL: 2467865; MANUFACTURER: ABS07-32.768KHZ-1-T
R0221 R0231 R0232 R0401 R0441 R0511 R0512 R0611 R0621-R0626 R0711 R0724 R0811 R0824 R0901-R0904 R0911-R0914 R0921-R0923 R0945 R0946 R0961-R0963 R0971 R0972 R1001-R1004 R1101-R1104 R1211 R1301 R1302 R1321 R1322 R1402 = df4iah_rcl:R-EU_: RESISTOR, European symbol
S0212 = df4iah_switch:KSR223G_SMD_1POL: KSR223G KSR Series Subminiature Tact Switch for SMT
TP_VBAT = testpad:PTR1: TEST PIN
U0101 = df4iah_stm32l4:STM32L476RXT_64PIN_LDO: STM32L476RxT 64LQFP
U0601 U0701 U0801 = df4iah_dataconvertion:MC33996: NXP MC33996 16 Output Switch with SPI Control - Low side switch
U0921 = df4iah_sc-switches:TS5A23166: TS5A23166 0.9-Ω Dual-SPST Analog Switch
U0941 = df4iah_powersupply:LM2611: IC REG CUK INV ADJ 1.2A SOT23-5 Cuk Switching Regulator IC Negative Adjustable -1.23V 1 Output 900mA SC-74A, SOT-753
U0951 U0961 = df4iah_opamp:OPA354: CMOS OPERATIONAL AMPLIFIERS; MPN: OPA354AIDBVT; OC_FARNELL: 1207050; OC_NEWARK: -; PACKAGE: SOT-23-5; SUPPLIER: Texas Instruments
U0962 = df4iah_dig-pot:MCP4661-104E-MS: Microchip MCP4661 8-Bit Dual I2C Digital POT with Nonvolatile Memory
U1001 U1101 = df4iah_dataconvertion:MAX232: RS232 TRANSCEIVER; MF: MAXIM; MPN: MAX232ECDR; OC_FARNELL: 2463694; OC_NEWARK: unknown
U1201 = df4iah_powersupply:LM53603-Q1: TI LM53603-Q1 3.5 V to 36 V Wide-VIN Synchronous 2.1 MHz Step- Down Converters for Automotive Applications
U1301 = df4iah_powersupply:TPS62051: TPS62051 800-mA Synchronous Step-Down Converter: 3.3V 12μA Quiescent Current 2.7-V to 10-V Operating Input Voltage Range 100% Maximum Duty Cycle for Lowest Dropout
X0201 = df4iah_connector:2X05_1MM27_SHROUDED_CORTEX_JTAG_SWD: Header 2X5 1.27mm 0.05" shrouded - CORTEX JTAG-SWD SAMTEC FTSH-105-01-F-D-K HARWIN M50-3500542
X0222 = df4iah_connector:HEADER-1X2: Header 1X2 2.54mm
X0501 = df4iah_connector:HEADER-2X2: Header 2X2 2.54mm
X1051-X1053 X1151-X1153 X1211 = df4iah_connector:WIRE-TO-BOARD_5MM08_1X02: Wire-to-Board connector 5.08mm 1x02
X1401 = df4iah_connector:USB_MICRO-B_MOLEX: USB Type Micro-B Connector Male/female and PTH/SMT variants Molex Products: Micro-USB B Receptacle, Bottom Mount, Surface Mount, with Solder Tabs, Lead-Free <http://www.molex.com/molex/products/datasheet.jsp?part=active/1050170001_IO_CONNECTORS.xml>
X1501 X1511 = df4iah_connector:SMA_SMT_AMPHENOL-901-143: RF/COAXIAL, SMA JACK, R/A, 50OHM, THD; MPN: 901-143; OC_FARNELL: 1461631; OC_NEWARK: 51F3841; PACKAGE: RF/COAXIAL, SMA JACK, R/A, 50OHM, THD; SUPPLIER: Amphenol
X1601 X1602 = df4iah_connector:2X10_2MM56_SOCKET: Header 2X10 2.54mm

## Net classes
1 pwr_relay: width 1.5 mm, clearance 0.5 mm
2 pwr_ttl: width 0.75 mm, clearance 0.5 mm
3 usb_pair: width 0.254 mm, clearance 0.152 mm
4 pwrA5: width 0.4 mm
5 single50R: width 0.838 mm, clearance 0.152 mm
6 mil6_nofill: width 0.152 mm, clearance 0.254 mm